# EAGLE schematic superH_rev4_release (EAGLE 7.6.0)

## Sheet 1 of 9
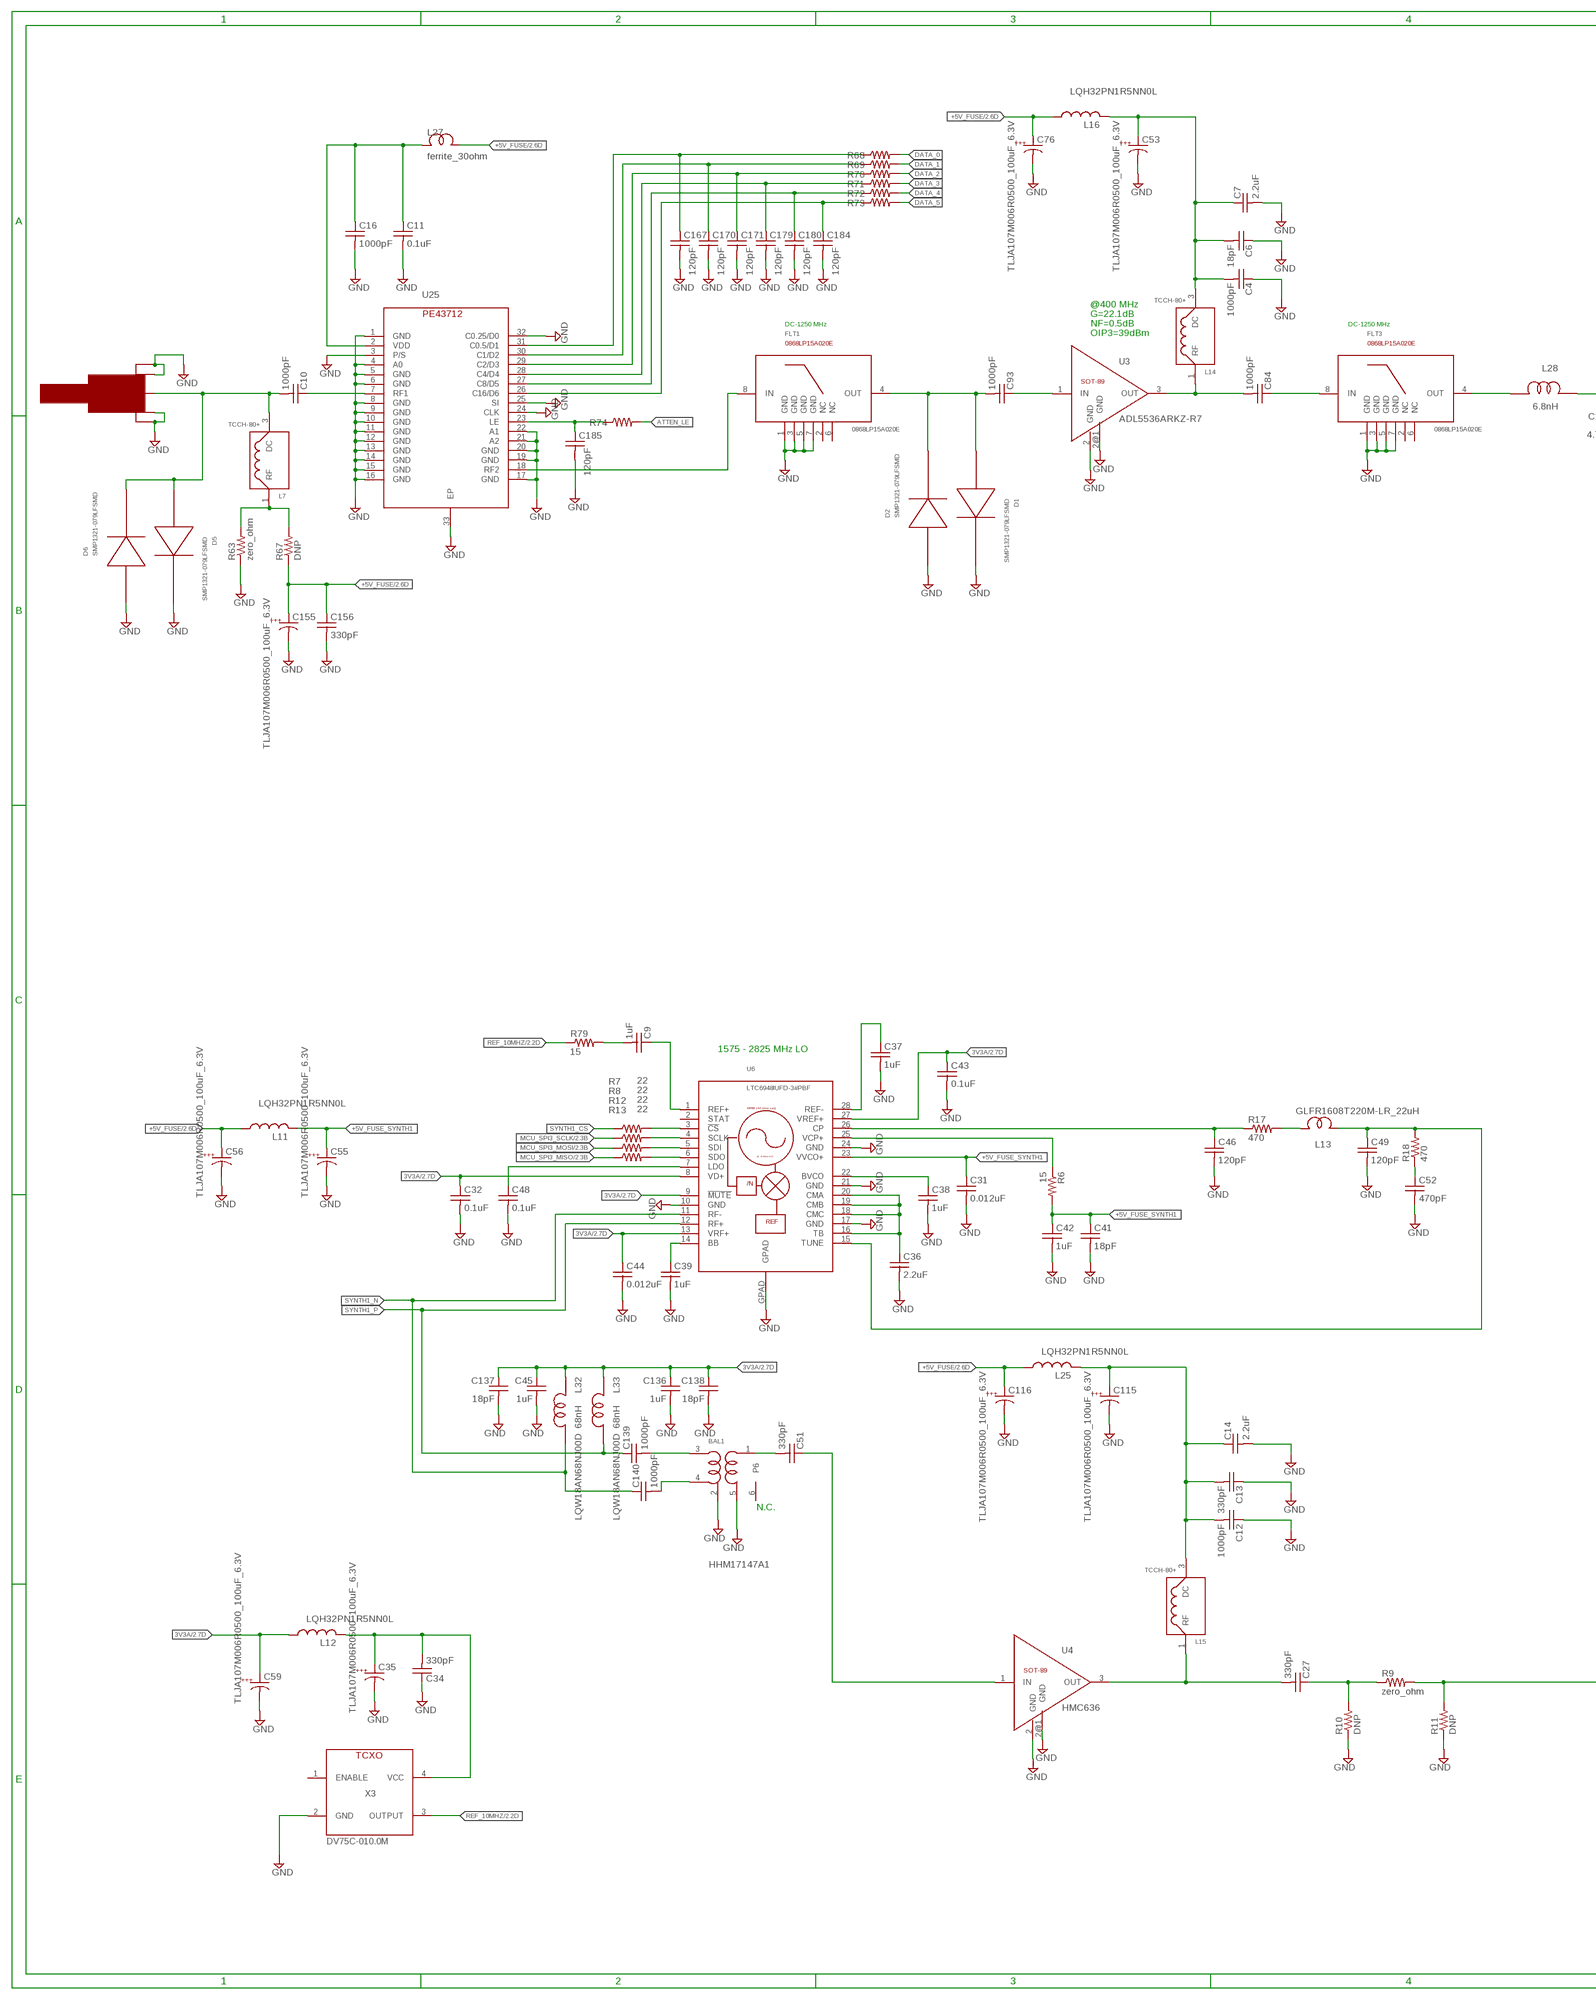
[diagram p0: schematic, sheet 1, part 1 of 2]
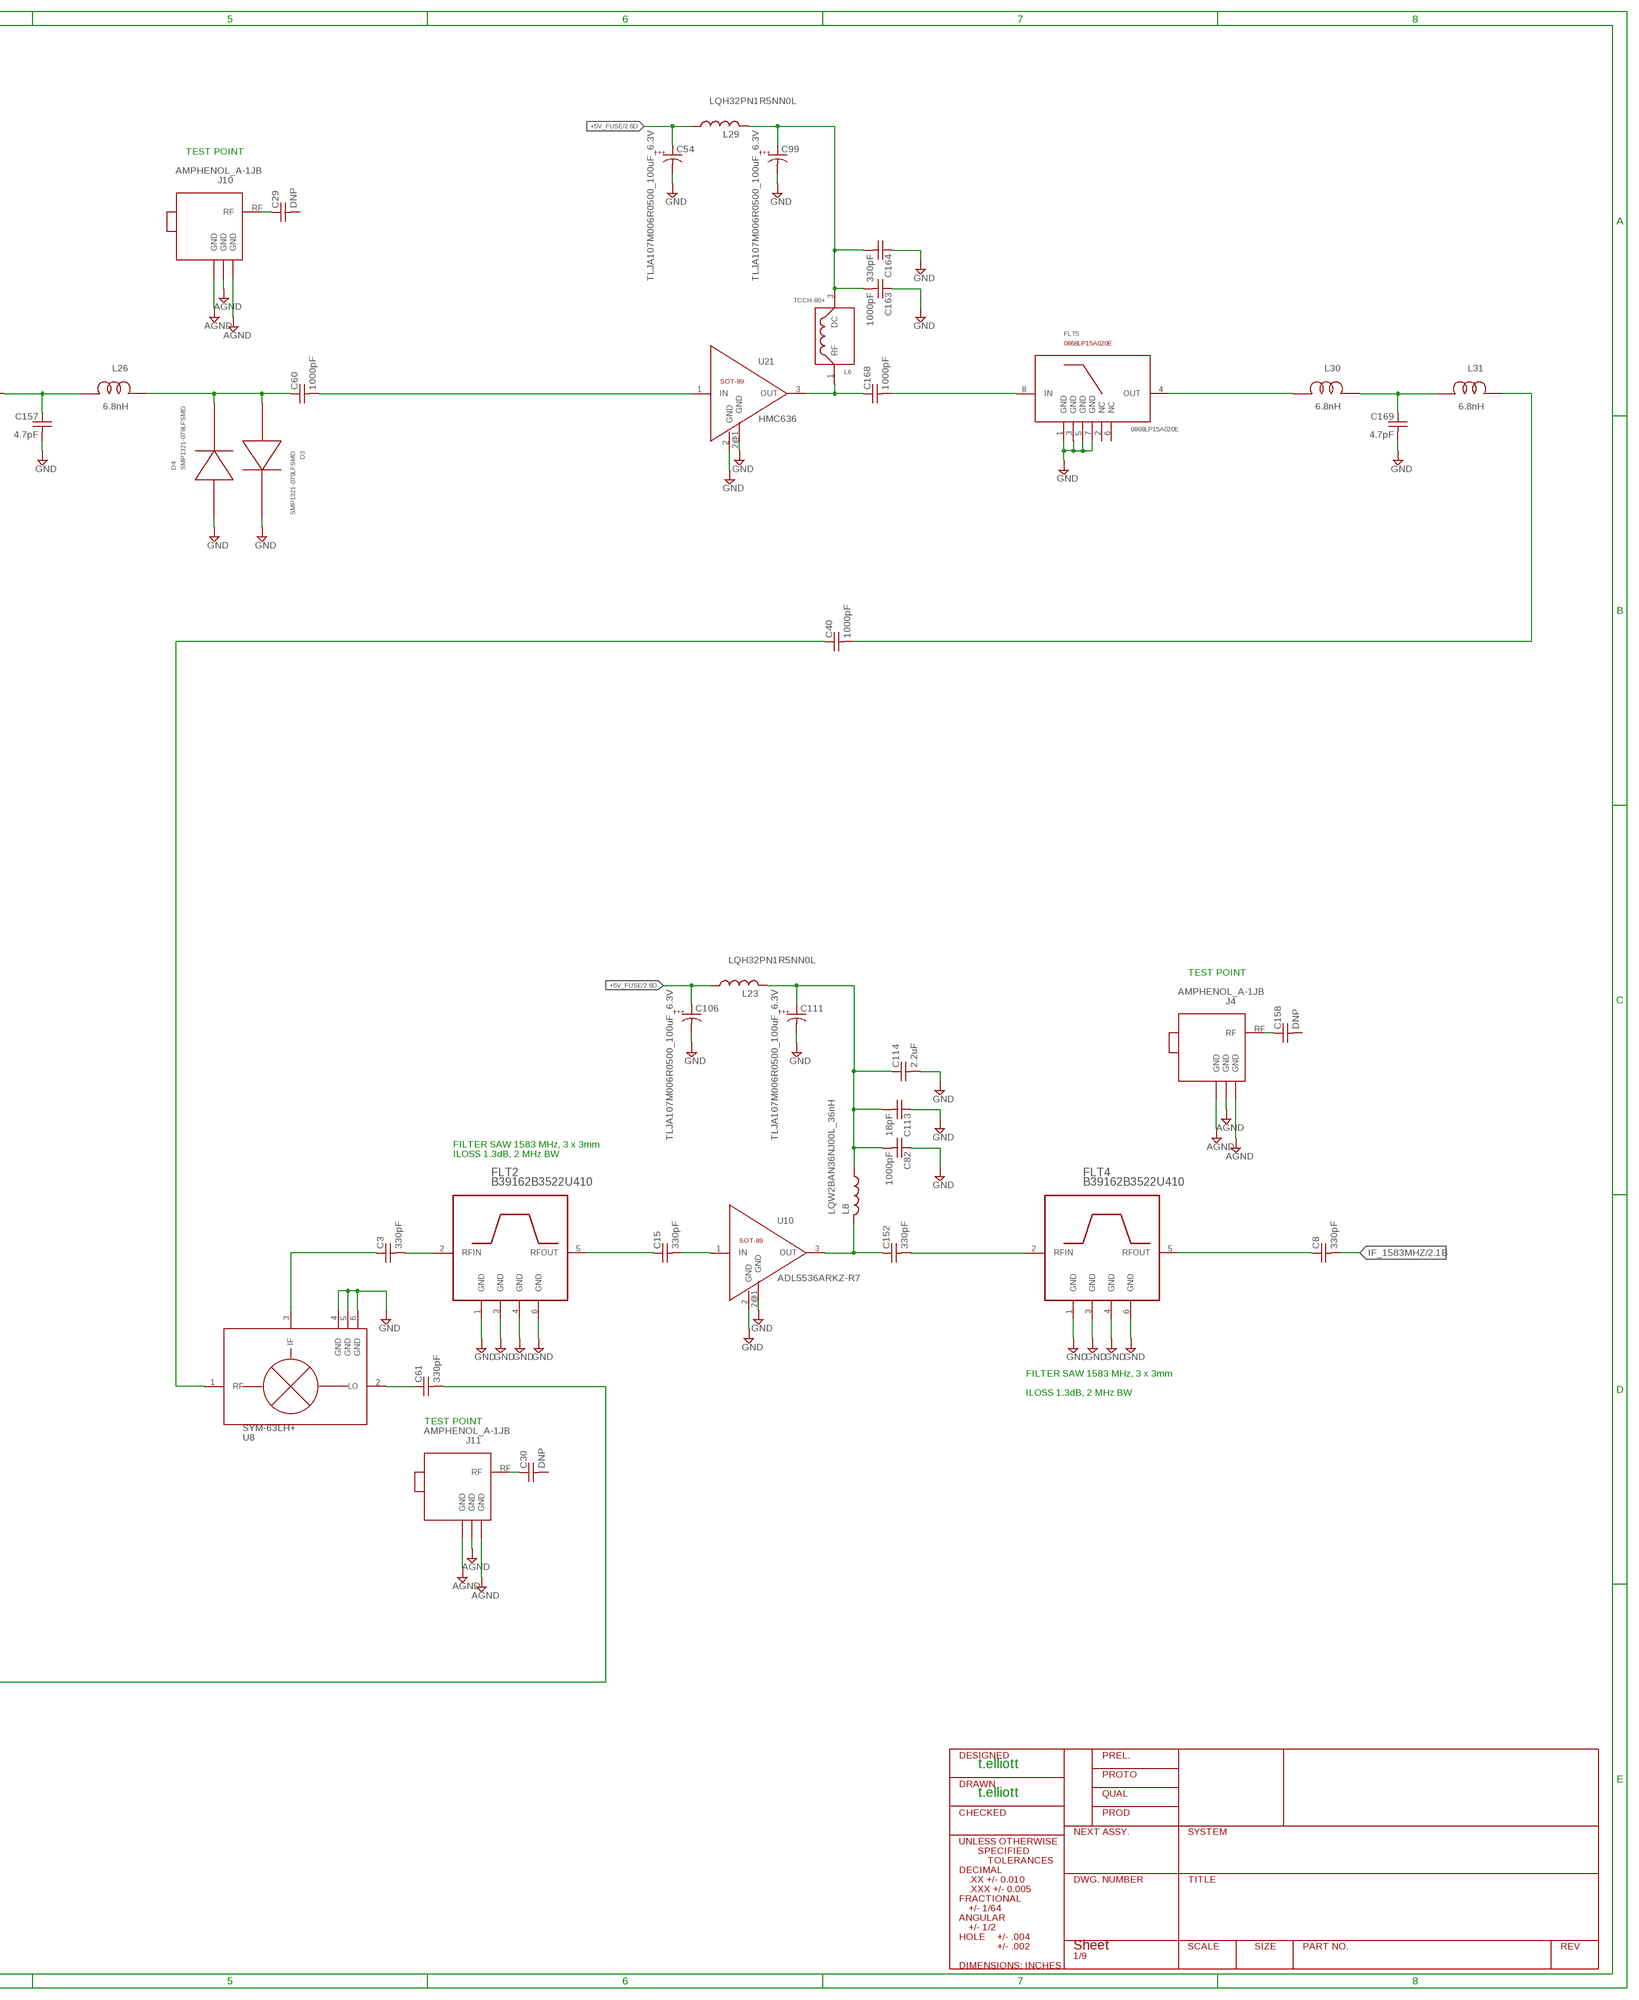
[diagram p1: schematic, sheet 1, part 2 of 2]

### Parts
BAL1  HHM17147A1  BALUN_TDK_HHM1522B1B  [TDK_BALUN_5PIN]
C3  330pF  C-USC0603  [C0603]
C4  1000pF  C-USC0603  [C0603]
C6  18pF  C-USC0603  [C0603]
C7  2.2uF  C-USC0603  [C0603]
C8  330pF  C-USC0603  [C0603]
C9  1uF  C-USC0603  [C0603]
C10  1000pF  C-USC0603  [C0603]
C11  0.1uF  C-USC0402  [C0402]
C12  1000pF  C-USC0603  [C0603]
C13  330pF  C-USC0603  [C0603]
C14  2.2uF  C-USC0603  [C0603]
C15  330pF  C-USC0603  [C0603]
C16  1000pF  C-USC0402  [C0402]
C27  330pF  C-USC0603  [C0603]
C29  DNP  C-USC0603  [C0603]
C30  DNP  C-USC0603  [C0603]
C31  0.012uF  C-USC0402  [C0402]
C32  0.1uF  C-USC0402  [C0402]
C34  330pF  C-USC0603  [C0603]
C35  TLJA107M006R0500_100uF_6.3V  CAPACITOR1210K  [1210K]
C36  2.2uF  C-USC0603  [C0603]
C37  1uF  C-USC0402  [C0402]
C38  1uF  C-USC0402  [C0402]
C39  1uF  C-USC0402  [C0402]
C40  1000pF  C-USC0603  [C0603]
C41  18pF  C-USC0402  [C0402]
C42  1uF  C-USC0402  [C0402]
C43  0.1uF  C-USC0402  [C0402]
C44  0.012uF  C-USC0402  [C0402]
C45  1uF  C-USC0603  [C0603]
C46  120pF  C-USC0402  [C0402]
C48  0.1uF  C-USC0402  [C0402]
C49  120pF  C-USC0402  [C0402]
C51  330pF  C-USC0603  [C0603]
C52  470pF  C-USC0402  [C0402]
C53  TLJA107M006R0500_100uF_6.3V  CAPACITOR1210K  [1210K]
C54  TLJA107M006R0500_100uF_6.3V  CAPACITOR1210K  [1210K]
C55  TLJA107M006R0500_100uF_6.3V  CAPACITOR1210K  [1210K]
C56  TLJA107M006R0500_100uF_6.3V  CAPACITOR1210K  [1210K]
C59  TLJA107M006R0500_100uF_6.3V  CAPACITOR1210K  [1210K]
C60  1000pF  C-USC0603  [C0603]
C61  330pF  C-USC0603  [C0603]
C76  TLJA107M006R0500_100uF_6.3V  CAPACITOR1210K  [1210K]
C82  1000pF  C-USC0603  [C0603]
C84  1000pF  C-USC0603  [C0603]
C93  1000pF  C-USC0603  [C0603]
C99  TLJA107M006R0500_100uF_6.3V  CAPACITOR1210K  [1210K]
C106  TLJA107M006R0500_100uF_6.3V  CAPACITOR1210K  [1210K]
C111  TLJA107M006R0500_100uF_6.3V  CAPACITOR1210K  [1210K]
C113  18pF  C-USC0603  [C0603]
C114  2.2uF  C-USC0603  [C0603]
C115  TLJA107M006R0500_100uF_6.3V  CAPACITOR1210K  [1210K]
C116  TLJA107M006R0500_100uF_6.3V  CAPACITOR1210K  [1210K]
C136  1uF  C-USC0603  [C0603]
C137  18pF  C-USC0603  [C0603]
C138  18pF  C-USC0603  [C0603]
C139  1000pF  C-USC0402  [C0402]
C140  1000pF  C-USC0402  [C0402]
C152  330pF  C-USC0603  [C0603]
C155  TLJA107M006R0500_100uF_6.3V  CAPACITOR1210K  [1210K]
C156  330pF  C-USC0603  [C0603]
C157  4.7pF  C-USC0603  [C0603]
C158  DNP  C-USC0603  [C0603]
C163  1000pF  C-USC0603  [C0603]
C164  330pF  C-USC0603  [C0603]
C167  120pF  C-USC0402  [C0402]
C168  1000pF  C-USC0603  [C0603]
C169  4.7pF  C-USC0603  [C0603]
C170  120pF  C-USC0402  [C0402]
C171  120pF  C-USC0402  [C0402]
C179  120pF  C-USC0402  [C0402]
C180  120pF  C-USC0402  [C0402]
C184  120pF  C-USC0402  [C0402]
C185  120pF  C-USC0402  [C0402]
D1  SMP1321-079LFSMD  [SC-79_PINDIODE]
D2  SMP1321-079LFSMD  [SC-79_PINDIODE]
D3  SMP1321-079LFSMD  [SC-79_PINDIODE]
D4  SMP1321-079LFSMD  [SC-79_PINDIODE]
D5  SMP1321-079LFSMD  [SC-79_PINDIODE]
D6  SMP1321-079LFSMD  [SC-79_PINDIODE]
FLT1  0868LP15A020E  [LPF_0868LP15A020]
FLT2  B39162B3522U410  SF2049E  [SM3030-6]
FLT3  0868LP15A020E  [LPF_0868LP15A020]
FLT4  B39162B3522U410  SF2049E  [SM3030-6]
FLT5  0868LP15A020E  [LPF_0868LP15A020]
J3  SMA0.062  [SMA_EDGE]
J4  AMPHENOL_A-1JB  [UFLCONNECTOR]
J10  AMPHENOL_A-1JB  [UFLCONNECTOR]
J11  AMPHENOL_A-1JB  [UFLCONNECTOR]
L6  TCCH-80+  TCCH-80+GU1604  [TCCH-80+]
L7  TCCH-80+  TCCH-80+GU1604  [TCCH-80+]
L8  LQW2BAN36NJ00L_36nH  L-USL2012C  [L2012C]
L11  LQH32PN1R5NN0L  L-USL3225M  [L3225M]
L12  LQH32PN1R5NN0L  L-USL3225M  [L3225M]
L13  GLFR1608T220M-LR_22uH  WE-CBF_0603  [0603]
L14  TCCH-80+  TCCH-80+GU1604  [TCCH-80+]
L15  TCCH-80+  TCCH-80+GU1604  [TCCH-80+]
L16  LQH32PN1R5NN0L  L-USL3225M  [L3225M]
L23  LQH32PN1R5NN0L  L-USL3225M  [L3225M]
L25  LQH32PN1R5NN0L  L-USL3225M  [L3225M]
L26  6.8nH  COILCRAFT_0806SQ-16N  [MURATA_LQW_0603]
L27  ferrite_30ohm  WE-CBF_0603  [0603]
L28  6.8nH  COILCRAFT_0806SQ-16N  [MURATA_LQW_0603]
L29  LQH32PN1R5NN0L  L-USL3225M  [L3225M]
L30  6.8nH  COILCRAFT_0806SQ-16N  [MURATA_LQW_0603]
L31  6.8nH  COILCRAFT_0806SQ-16N  [MURATA_LQW_0603]
L32  LQW18AN68NJ00D 68nH  COILCRAFT_0806SQ-16N  [MURATA_LQW_0603]
L33  LQW18AN68NJ00D 68nH  COILCRAFT_0806SQ-16N  [MURATA_LQW_0603]
R6  15  R-US_R0402  [R0402]
R7  22  R-US_R0402  [R0603_COMPACT]
R8  22  R-US_R0402  [R0603_COMPACT]
R9  zero_ohm  R-US_R0603  [R0603]
R10  DNP  R-US_R0603  [R0603]
R11  DNP  R-US_R0603  [R0603]
R12  22  R-US_R0402  [R0603_COMPACT]
R13  22  R-US_R0402  [R0603_COMPACT]
R17  470  R-US_R0402  [R0402]
R18  470  R-US_R0402  [R0402]
R63  zero_ohm  R-US_R1206  [R1206]
R67  DNP  R-US_R1206  [R1206]
R68  15  R-US_R0402  [R0402]
R69  15  R-US_R0402  [R0402]
R70  15  R-US_R0402  [R0402]
R71  15  R-US_R0402  [R0402]
R72  15  R-US_R0402  [R0402]
R73  15  R-US_R0402  [R0402]
R74  15  R-US_R0402  [R0402]
R79  15  R-US_R0402  [R0402]
U3  ADL5536ARKZ-R7  PGA-103+  [SOT89]
U4  HMC636  PGA-103+  [SOT89]
U6  LTC6948IUFD-3#PBF  LTC6948QFN28  [QFN28_NONSQ]
U8  SYM-63LH+  SYM-18H+  [SYM-18H]
U10  ADL5536ARKZ-R7  PGA-103+  [SOT89]
U21  HMC636  PGA-103+  [SOT89]
U25  PE43712SMD  [QFN32]
X3  DV75C-010.0M  CWX813-020.0M  [CWX8XX_5MM_7MM]

### Nets
3V3A: C32.1 C43.1 C44.1 C45.1 C59.A C136.1 C137.1 C138.1 L12.1 L32.2 L33.2 U6.8(VD+) U6.9(!MUTE) U6.13(VRF+) U6.27(VREF+) ; also sheet 2,5,8
+5V_ATTEN: C11.1 C16.1 L27.1 U25.2(VDD)
+5V_FUSE: C54.A C56.A C76.A C106.A C116.A C155.A C156.1 L11.1 L16.1 L23.1 L25.1 L27.2 L29.1 R67.1 ; also sheet 2,8
+5V_FUSE_SYNTH1: C31.1 C41.1 C42.1 C55.A L11.2 R6.2 U6.23(VVCO+)
ATTEN_LE: R74.2 ; also sheet 4
BALUN_N [differential]: BAL1.4(BP1) C140.2
BALUN_P [differential]: BAL1.3(BP2) C139.2
D0: C167.1 R68.1 U25.31(C0.5/D1)
D1: C170.1 R69.1 U25.30(C1/D2)
D2: C171.1 R70.1 U25.29(C2/D3)
D3: C179.1 R71.1 U25.28(C4/D4)
D4: C180.1 R72.1 U25.27(C8/D5)
D5: C184.1 R73.1 U25.26(C16/D6)
DATA_0: R68.2 ; also sheet 2,3
DATA_1: R69.2 ; also sheet 2,3
DATA_2: R70.2 ; also sheet 2,3
DATA_3: R71.2 ; also sheet 2,3
DATA_4: R72.2 ; also sheet 4
DATA_5: R73.2 ; also sheet 3
GND: BAL1.2(FEED) BAL1.5(GND) C4.1 C6.1 C7.2 C11.2 C12.1 C13.1 C14.2 C16.2 C31.2 C32.2 C34.1 C35.C C36.2 C37.2 C38.2 C39.2 C41.2 C42.2 C43.2 C44.2 C45.2 C46.2 C48.2 C49.2 C52.2 C53.C C54.C C55.C C56.C C59.C C76.C C82.1 C99.C C106.C C111.C C113.1 C114.2 C115.C C116.C C136.2 C137.2 C138.2 C155.C C156.2 C157.2 C163.1 C164.1 C167.2 C169.2 C170.2 C171.2 C179.2 C180.2 C184.2 C185.2 D1.C D2.A D3.C D4.A D5.C D6.A FLT1.1(GND) FLT1.3(GND) FLT1.5(GND) FLT1.7(GND) FLT2.1(GND) FLT2.3(GND) FLT2.4(GND) FLT2.6(GND) FLT3.1(GND) FLT3.3(GND) FLT3.5(GND) FLT3.7(GND) FLT4.1(GND) FLT4.3(GND) FLT4.4(GND) FLT4.6(GND) FLT5.1(GND) FLT5.3(GND) FLT5.5(GND) FLT5.7(GND) J3.GND@1(GND) J3.GND@2(GND) J3.GND@3(GND) J3.GND@4(GND) J4.1(GND) J4.2(GND) J4.3(GND) J10.1(GND) J10.2(GND) J10.3(GND) J11.1(GND) J11.2(GND) J11.3(GND) R10.1 R11.1 R63.1 U3.2(GND) U3.2@1(GND) U4.2(GND) U4.2@1(GND) U6.10(GND) U6.17(GND) U6.21(GND) U6.24(GND) U6.GPAD U8.4(GND) U8.5(GND) U8.6(GND) U10.2(GND) U10.2@1(GND) U21.2(GND) U21.2@1(GND) U25.1(GND) U25.3(P/S) U25.4(A0) U25.5(GND) U25.6(GND) U25.8(GND) U25.9(GND) U25.10(GND) U25.11(GND) U25.12(GND) U25.13(GND) U25.14(GND) U25.15(GND) U25.16(GND) U25.17(GND) U25.19(GND) U25.20(GND) U25.21(A2) U25.22(A1) U25.24(CLK) U25.25(SI) U25.32(C0.25/D0) U25.33(EP) X3.2(GND) ; supply symbol labelled AGND ; also sheet 2,3,4,5,6,7,8,9
IF_1583MHZ: C8.2 ; also sheet 2
LE: C185.1 R74.1 U25.23(LE)
MCU_SPI3_MISO: R13.1 ; also sheet 2,4
MCU_SPI3_MOSI: R12.1 ; also sheet 2,4
MCU_SPI3_SCLK: R8.1 ; also sheet 2,4
N$1: C152.2 FLT4.2(RFIN)
N$2: C84.2 L14.1(RF) U3.3(OUT)
N$5: C82.2 C111.A C113.2 C114.1 L8.1 L23.2
N$14: C60.1 D3.A D4.C L26.2
N$18: C27.2 L15.1(RF) U4.3(OUT)
N$31: C29.1 J10.RF
N$32: C30.1 J11.RF
N$36: C15.1 FLT2.5(RFOUT)
N$39: C3.2 FLT2.2(RFIN)
N$44: C51.1 U4.1(IN)
N$45: C15.2 U10.1(IN)
N$47: C9.1 U6.1(REF+)
N$48: C27.1 R9.1 R10.2
N$49: C61.2 R9.2 R11.2
N$50: C4.2 C6.2 C7.1 C53.A L14.3(DC) L16.2
N$52: C8.1 FLT4.5(RFOUT)
N$58: FLT1.8(IN) U25.18(RF2)
N$61: C99.A C163.2 C164.2 L6.3(DC) L29.2
N$64: C37.1 U6.28(REF-)
N$67: C36.1 U6.16(TB) U6.18(CMC) U6.19(CMB) U6.20(CMA)
N$73: C38.1 U6.22(BVCO)
N$75: C39.1 U6.14(BB)
N$78: R6.1 U6.25(VCP+)
N$79: C48.1 U6.7(LDO)
N$80: C46.1 R17.1 U6.26(CP)
N$81: C61.1 U8.2(LO)
N$82: C93.1 U3.1(IN)
N$87: BAL1.1(UBAL) C51.2
N$88: C52.1 R18.1
N$89: C49.1 L13.2 R18.2 U6.15(TUNE)
N$90: L13.1 R17.2
N$93: C93.2 D1.A D2.C FLT1.4(OUT)
N$97: R7.2 U6.3(!CS)
N$101: R8.2 U6.4(SCLK)
N$102: R12.2 U6.5(SDI)
N$103: R13.2 U6.6(SDO)
N$105: C34.2 C35.A L12.2 X3.4(VCC)
N$106: C3.1 U8.3(IF)
N$107: C157.1 L26.1 L28.2
N$113: FLT3.4(OUT) L28.1
N$121: L7.1(RF) R63.2 R67.2
N$136: C152.1 L8.2 U10.3(OUT)
N$137: C84.1 FLT3.8(IN)
N$138: C158.1 J4.RF
N$144: C60.2 U21.1(IN)
N$145: C168.1 L6.1(RF) U21.3(OUT)
N$146: C40.1 U8.1(RF)
N$147: FLT5.4(OUT) L30.1
N$148: C169.1 L30.2 L31.1
N$149: C168.2 FLT5.8(IN)
N$151: C40.2 L31.2
N$188: C10.1 U25.7(RF1)
N$195: C10.2 D5.A D6.C J3.RF L7.3(DC)
N$205: C9.2 R79.2
N$999: C12.2 C13.2 C14.1 C115.A L15.3(DC) L25.2
REF_10MHZ: R79.1 X3.3(OUTPUT) ; also sheet 2
SYNTH1_CS: R7.1 ; also sheet 3
SYNTH1_N [differential]: C140.1 L32.1 U6.11(RF-)
SYNTH1_P [differential]: C139.1 L33.1 U6.12(RF+)
Unconnected: BAL1.6 C29.2 C30.2 C158.2 FLT1.2(NC) FLT1.6(NC) FLT3.2(NC) FLT3.6(NC) FLT5.2(NC) FLT5.6(NC) U6.2(STAT) X3.1(ENABLE)

### Notes on the sheet
- TEST POINT
- @400 MHz
- G=22.1dB
- DC-1250 MHz | NF=0.5dB | DC-1250 MHz
- OIP3=39dBm
- TEST POINT
- 1575 - 2825 MHz LO
- FILTER SAW 1583 MHz, 3 x 3mm
- ILOSS 1.3dB, 2 MHz BW
- FILTER SAW 1583 MHz, 3 x 3mm
- ILOSS 1.3dB, 2 MHz BW
- TEST POINT
- N.C.
- t.elliott
- t.elliott

## Sheet 2 of 9
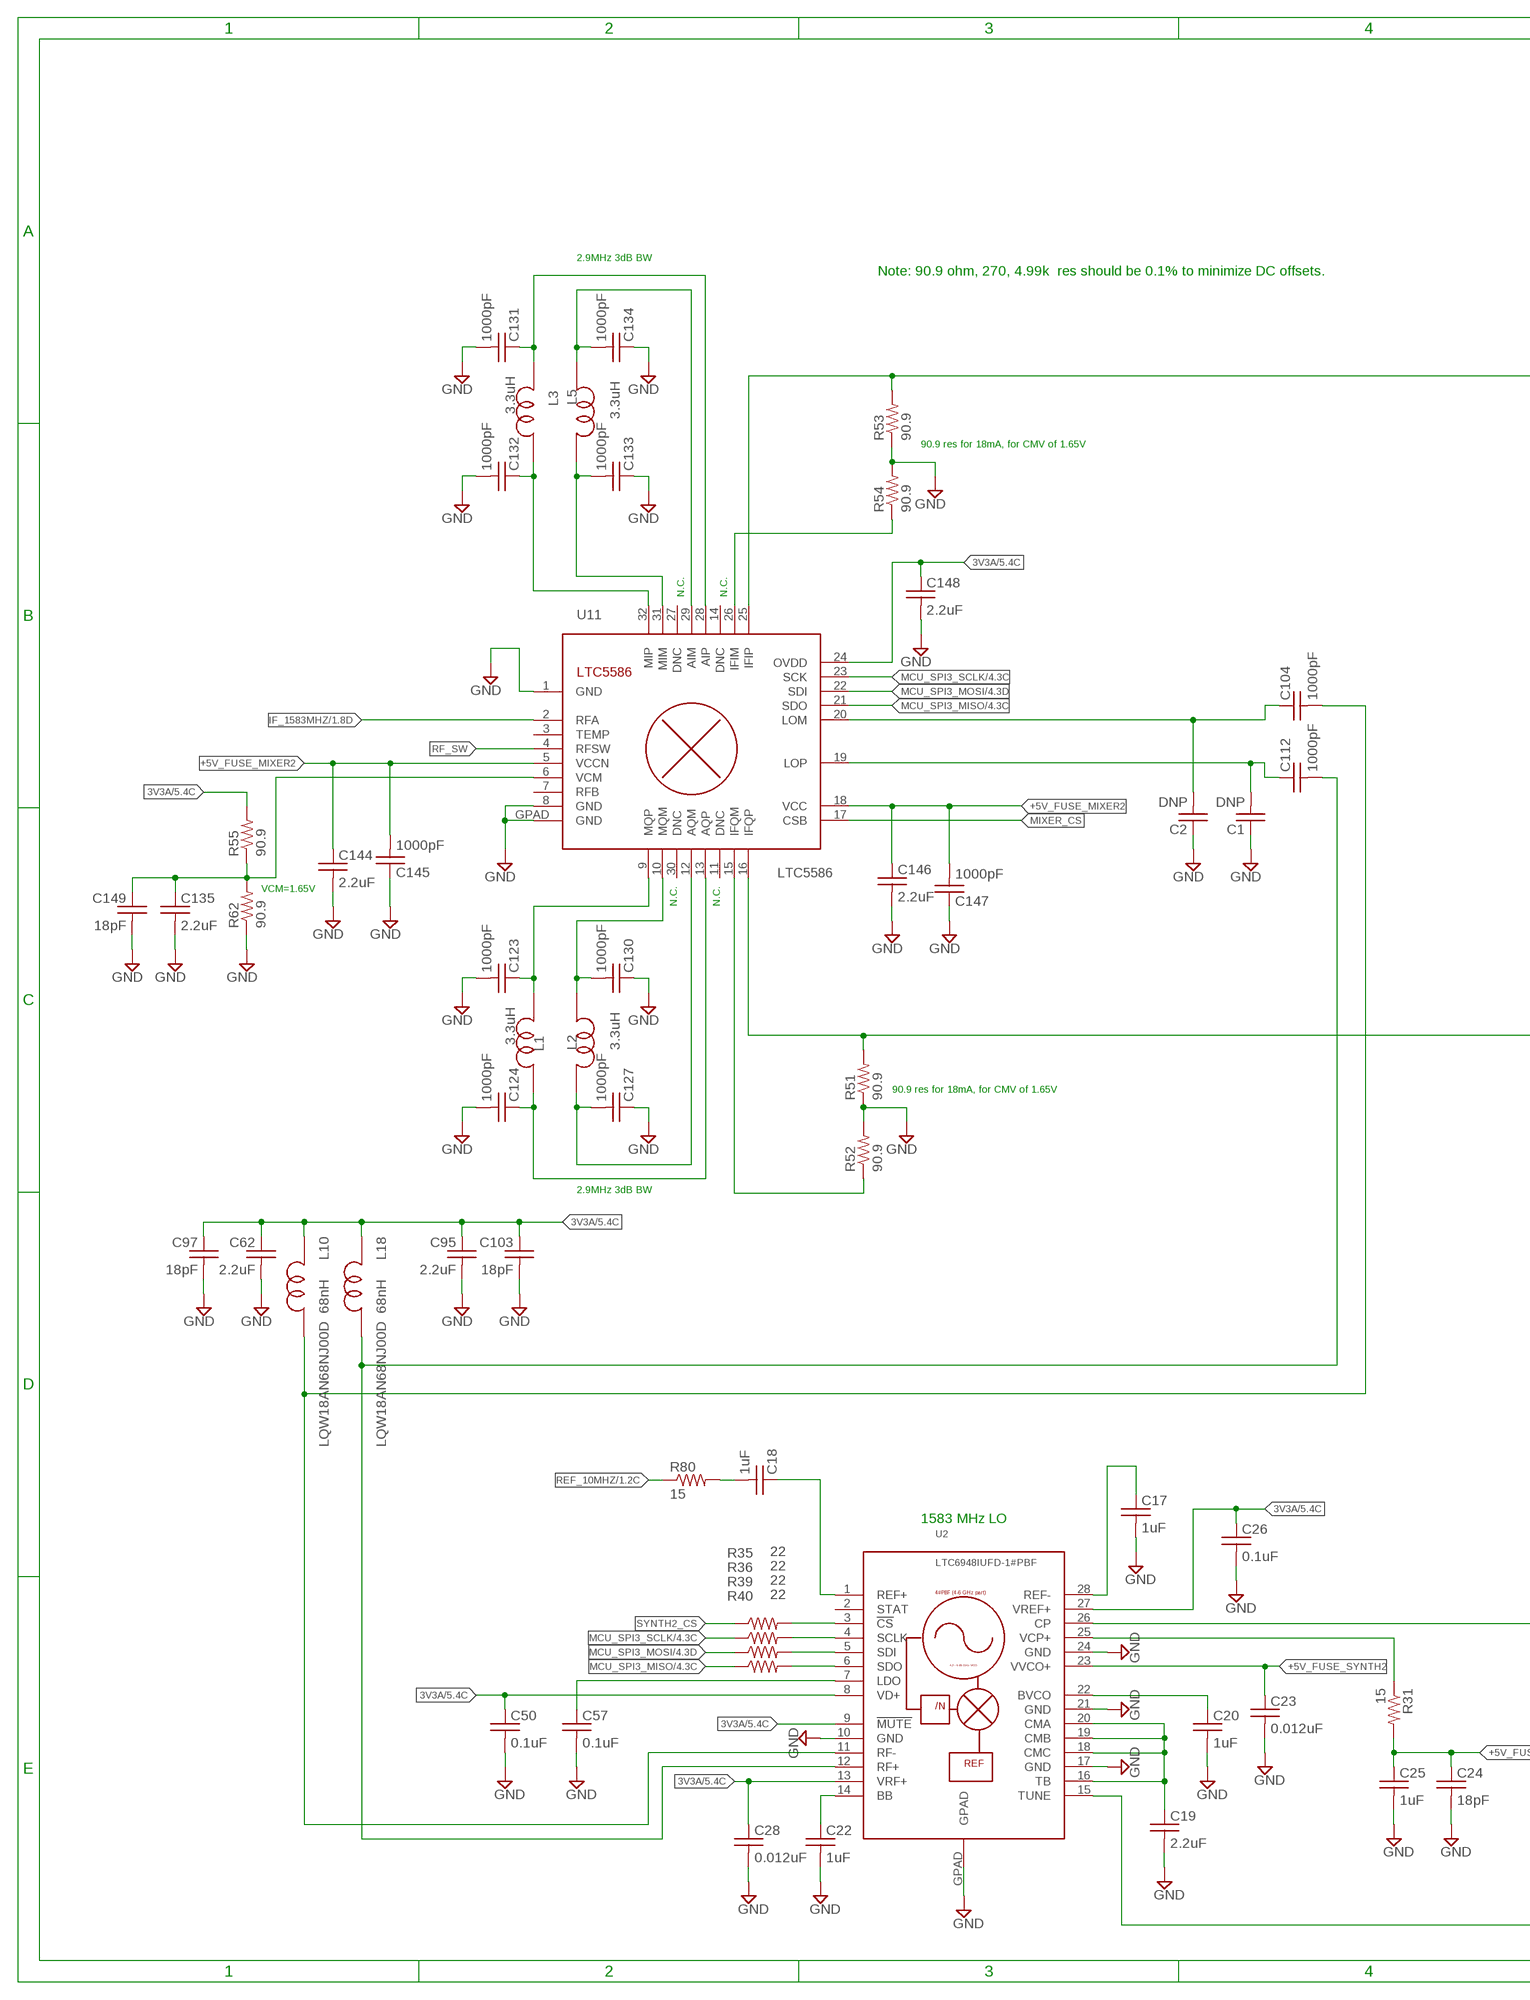
[diagram p2: schematic, sheet 2, part 1 of 2]
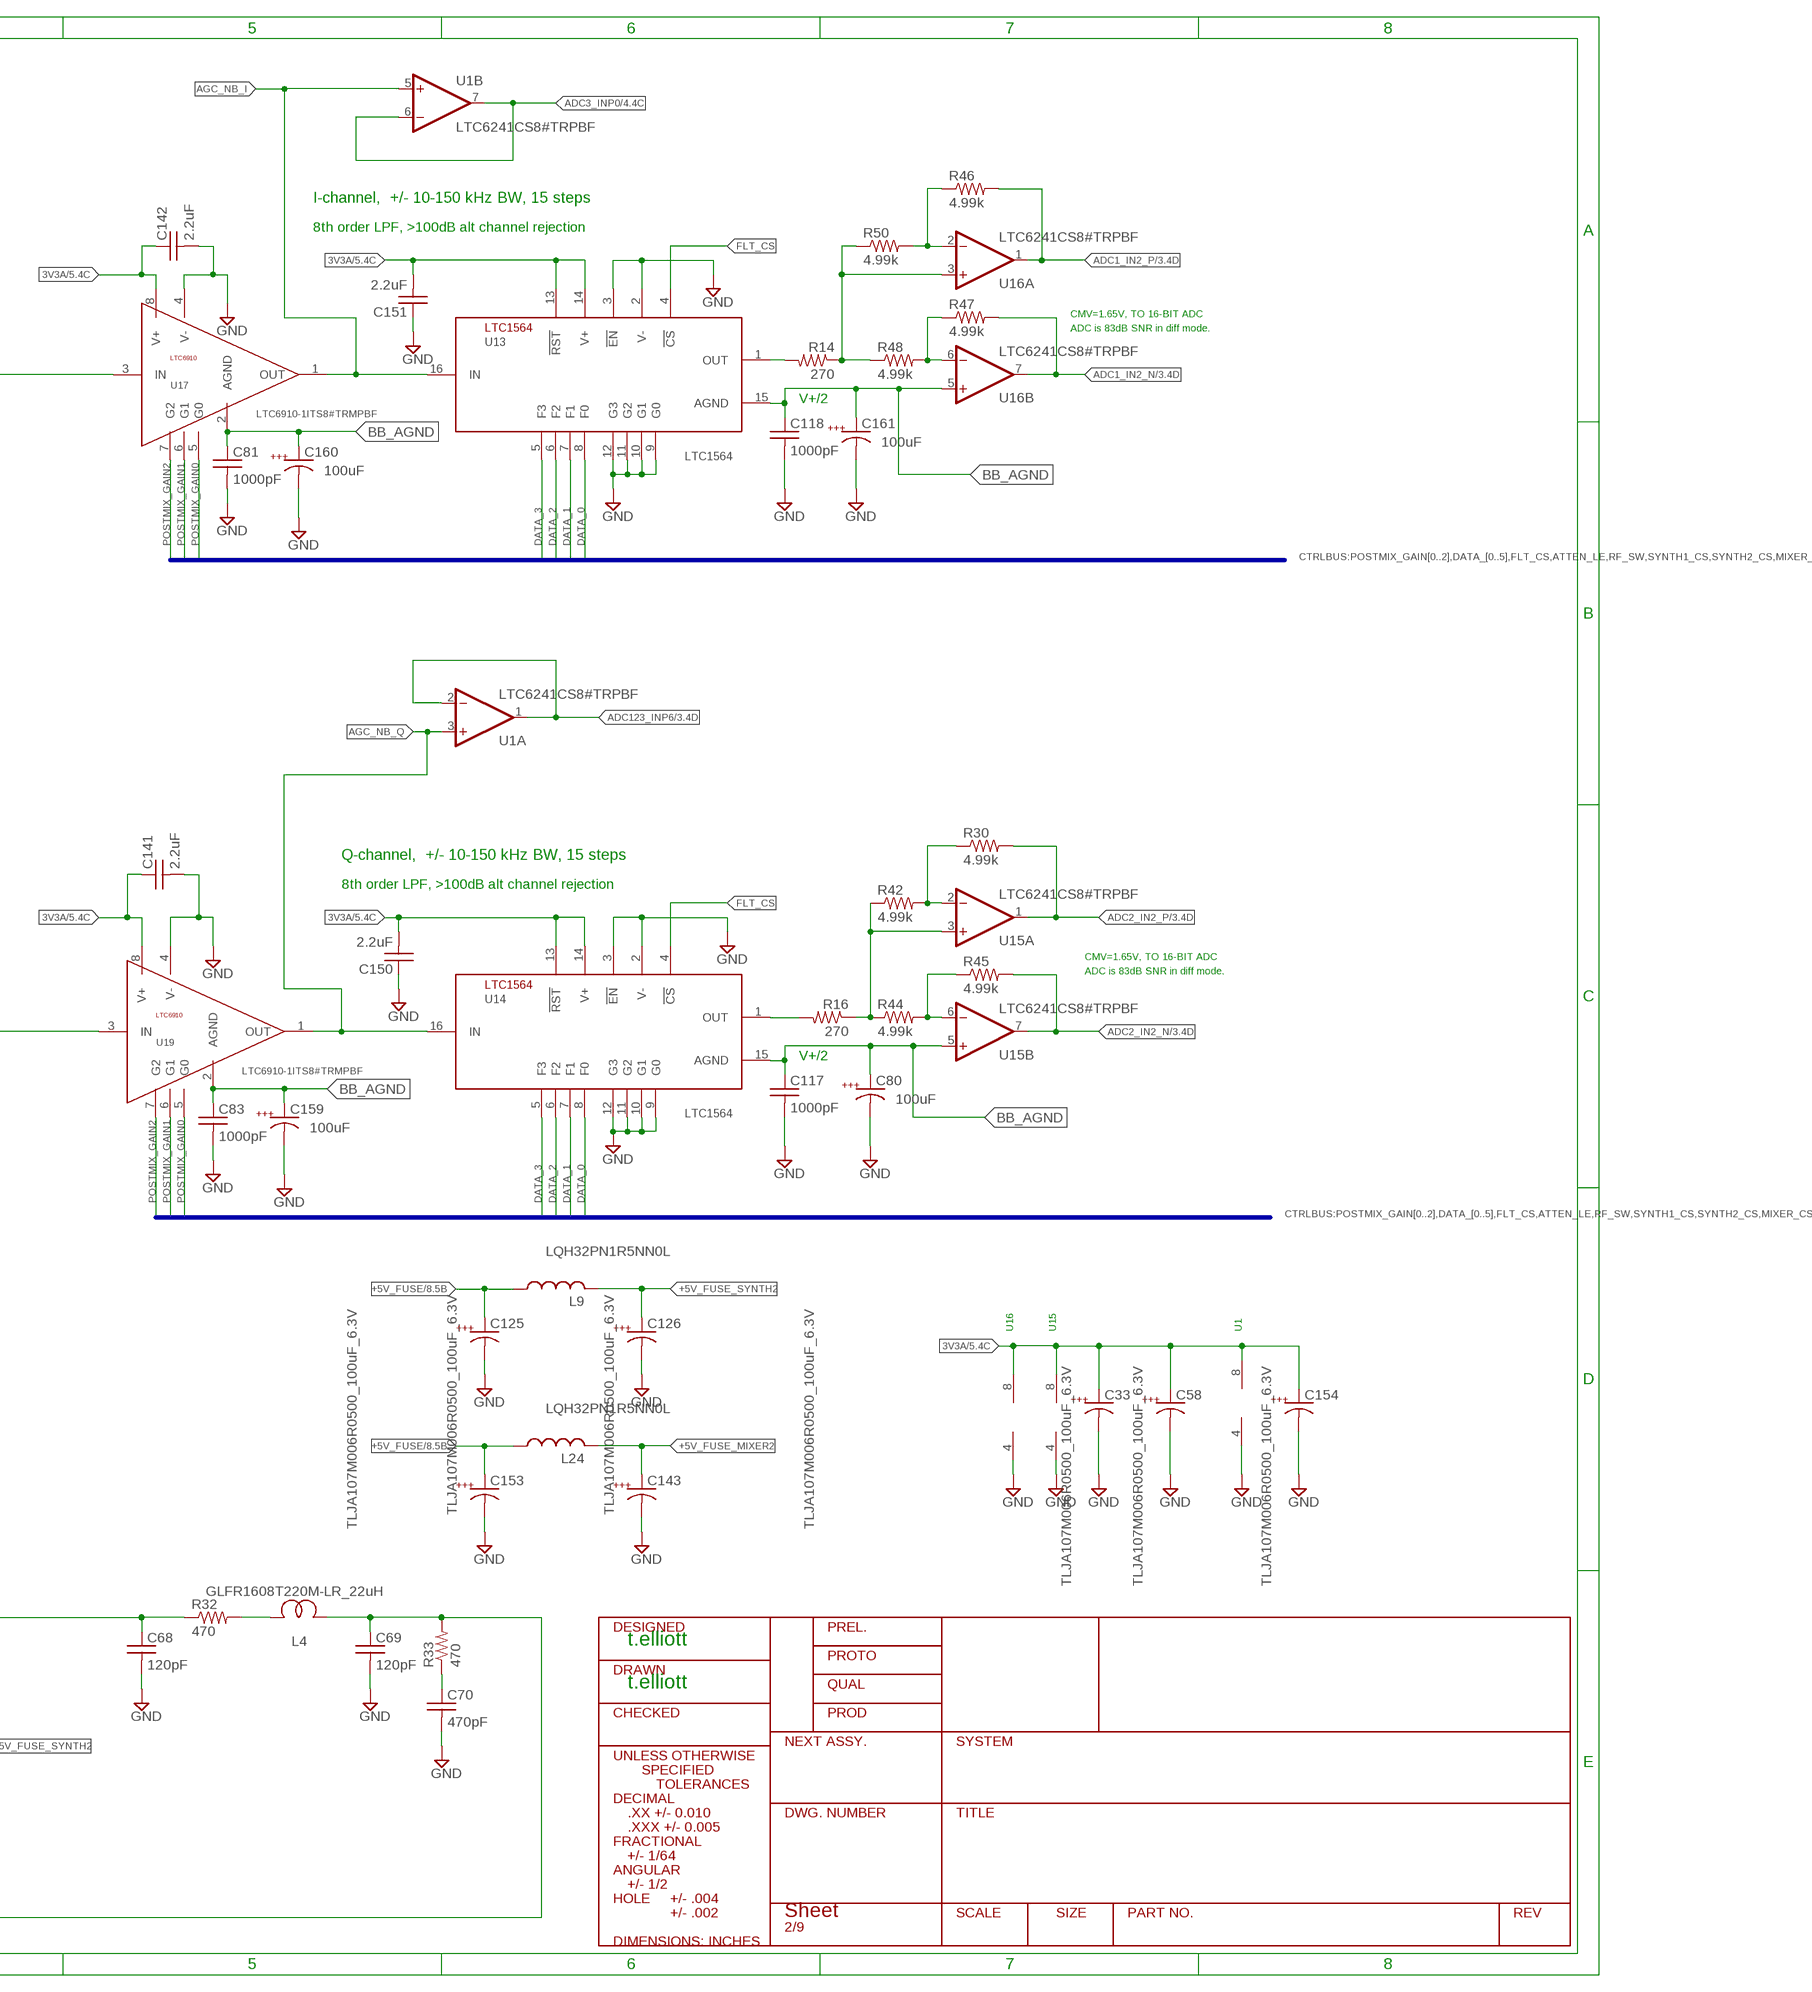
[diagram p3: schematic, sheet 2, part 2 of 2]

### Parts
C1  DNP  C-USC0402  [C0402]
C2  DNP  C-USC0402  [C0402]
C17  1uF  C-USC0402  [C0402]
C18  1uF  C-USC0603  [C0603]
C19  2.2uF  C-USC0603  [C0603]
C20  1uF  C-USC0402  [C0402]
C22  1uF  C-USC0402  [C0402]
C23  0.012uF  C-USC0402  [C0402]
C24  18pF  C-USC0402  [C0402]
C25  1uF  C-USC0402  [C0402]
C26  0.1uF  C-USC0402  [C0402]
C28  0.012uF  C-USC0402  [C0402]
C33  TLJA107M006R0500_100uF_6.3V  CAPACITOR1210K  [1210K]
C50  0.1uF  C-USC0402  [C0402]
C57  0.1uF  C-USC0402  [C0402]
C58  TLJA107M006R0500_100uF_6.3V  CAPACITOR1210K  [1210K]
C62  2.2uF  C-USC0603  [C0603]
C68  120pF  C-USC0402  [C0402]
C69  120pF  C-USC0402  [C0402]
C70  470pF  C-USC0402  [C0402]
C80  100uF  CAPACITOR1210K  [1210K]
C81  1000pF  C-USC0603  [C0603]
C83  1000pF  C-USC0603  [C0603]
C95  2.2uF  C-USC0603  [C0603]
C97  18pF  C-USC0603  [C0603]
C103  18pF  C-USC0603  [C0603]
C104  1000pF  C-USC0402  [C0402]
C112  1000pF  C-USC0402  [C0402]
C117  1000pF  C-USC0603  [C0603]
C118  1000pF  C-USC0603  [C0603]
C123  1000pF  C-USC0603  [C0603]
C124  1000pF  C-USC0603  [C0603]
C125  TLJA107M006R0500_100uF_6.3V  CAPACITOR1210K  [1210K]
C126  TLJA107M006R0500_100uF_6.3V  CAPACITOR1210K  [1210K]
C127  1000pF  C-USC0603  [C0603]
C130  1000pF  C-USC0603  [C0603]
C131  1000pF  C-USC0603  [C0603]
C132  1000pF  C-USC0603  [C0603]
C133  1000pF  C-USC0603  [C0603]
C134  1000pF  C-USC0603  [C0603]
C135  2.2uF  C-USC0603  [C0603]
C141  2.2uF  C-USC0402  [C0402]
C142  2.2uF  C-USC0402  [C0402]
C143  TLJA107M006R0500_100uF_6.3V  CAPACITOR1210K  [1210K]
C144  2.2uF  C-USC0402  [C0402]
C145  1000pF  C-USC0402  [C0402]
C146  2.2uF  C-USC0402  [C0402]
C147  1000pF  C-USC0402  [C0402]
C148  2.2uF  C-USC0402  [C0402]
C149  18pF  C-USC0603  [C0603]
C150  2.2uF  C-USC0402  [C0402]
C151  2.2uF  C-USC0402  [C0402]
C153  TLJA107M006R0500_100uF_6.3V  CAPACITOR1210K  [1210K]
C154  TLJA107M006R0500_100uF_6.3V  CAPACITOR1210K  [1210K]
C159  100uF  CAPACITOR1210K  [1210K]
C160  100uF  CAPACITOR1210K  [1210K]
C161  100uF  CAPACITOR1210K  [1210K]
L1  3.3uH  COILCRAFT_0806SQ-16N  [MURATA_LQW_0603]
L2  3.3uH  COILCRAFT_0806SQ-16N  [MURATA_LQW_0603]
L3  3.3uH  COILCRAFT_0806SQ-16N  [MURATA_LQW_0603]
L4  GLFR1608T220M-LR_22uH  WE-CBF_0603  [0603]
L5  3.3uH  COILCRAFT_0806SQ-16N  [MURATA_LQW_0603]
L9  LQH32PN1R5NN0L  L-USL3225M  [L3225M]
L10  LQW18AN68NJ00D 68nH  COILCRAFT_0806SQ-16N  [MURATA_LQW_0603]
L18  LQW18AN68NJ00D 68nH  COILCRAFT_0806SQ-16N  [MURATA_LQW_0603]
L24  LQH32PN1R5NN0L  L-USL3225M  [L3225M]
R14  270  R-US_R0603  [R0603]
R16  270  R-US_R0603  [R0603]
R30  4.99k  R-US_R0402  [R0402]
R31  15  R-US_R0402  [R0402]
R32  470  R-US_R0402  [R0402]
R33  470  R-US_R0402  [R0402]
R35  22  R-US_R0402  [R0603_COMPACT]
R36  22  R-US_R0402  [R0603_COMPACT]
R39  22  R-US_R0402  [R0603_COMPACT]
R40  22  R-US_R0402  [R0603_COMPACT]
R42  4.99k  R-US_R0402  [R0402]
R44  4.99k  R-US_R0402  [R0402]
R45  4.99k  R-US_R0402  [R0402]
R46  4.99k  R-US_R0402  [R0402]
R47  4.99k  R-US_R0402  [R0402]
R48  4.99k  R-US_R0402  [R0402]
R50  4.99k  R-US_R0402  [R0402]
R51  90.9  R-US_R0402  [R0402]
R52  90.9  R-US_R0402  [R0402]
R53  90.9  R-US_R0402  [R0402]
R54  90.9  R-US_R0402  [R0402]
R55  90.9  R-US_R0402  [R0402]
R62  90.9  R-US_R0402  [R0402]
R80  15  R-US_R0402  [R0402]
U1  LTC6241CS8#TRPBF  LM1458D  [SO08]
U2  LTC6948IUFD-1#PBF  LTC6948QFN28  [QFN28_NONSQ]
U11  LTC5586  [QFN32]
U13  LTC1564  [SSOP16]
U14  LTC1564  [SSOP16]
U15  LTC6241CS8#TRPBF  LM1458D  [SO08]
U16  LTC6241CS8#TRPBF  LM1458D  [SO08]
U17  LTC6910-1ITS8#TRMPBF  LTC6910  [TSOT-23-8]
U19  LTC6910-1ITS8#TRMPBF  LTC6910  [TSOT-23-8]

### Nets
3V3A: C26.1 C28.1 C33.A C50.1 C58.A C62.1 C95.1 C97.1 C103.1 C141.1 C142.1 C148.1 C150.2 C151.2 C154.A L10.2 L18.2 R55.2 U1.8(P:V+) U2.8(VD+) U2.9(!MUTE) U2.13(VRF+) U2.27(VREF+) U11.24(OVDD) U13.13(!RST) U13.14(V+) U14.13(!RST) U14.14(V+) U15.8(P:V+) U16.8(P:V+) U17.8(V+) U19.8(V+) ; also sheet 1,5,8
+5V_FUSE: C125.A C153.A L9.1 L24.1 ; also sheet 1,8
+5V_FUSE_MIXER2: C143.A C144.1 C145.2 C146.1 C147.2 L24.2 U11.5(VCCN) U11.18(VCC)
+5V_FUSE_SYNTH2: C23.1 C24.1 C25.1 C126.A L9.2 R31.2 U2.23(VVCO+)
ADC1_IN2_N [differential]: R47.2 U16.7(B:OUT) ; also sheet 3
ADC1_IN2_P [differential]: R46.2 U16.1(A:OUT) ; also sheet 3
ADC2_IN2_N [differential]: R45.2 U15.7(B:OUT) ; also sheet 3
ADC2_IN2_P [differential]: R30.2 U15.1(A:OUT) ; also sheet 3
ADC3_INP0: U1.6(B:-IN) U1.7(B:OUT) ; also sheet 4
ADC123_INP6: U1.1(A:OUT) U1.2(A:-IN) ; also sheet 3
AGC_NB_I: U1.5(B:+IN) U13.16(IN) U17.1(OUT)
AGC_NB_Q: U1.3(A:+IN) U14.16(IN) U19.1(OUT)
BB_AGND: C80.A C81.1 C83.1 C117.1 C118.1 C159.A C160.A C161.A U13.15(AGND) U14.15(AGND) U15.5(B:+IN) U16.5(B:+IN) U17.2(AGND) U19.2(AGND)
DATA_0: U13.8(F0) U14.8(F0) ; also sheet 1,3
DATA_1: U13.7(F1) U14.7(F1) ; also sheet 1,3
DATA_2: U13.6(F2) U14.6(F2) ; also sheet 1,3
DATA_3: U13.5(F3) U14.5(F3) ; also sheet 1,3
FLT_CS: U13.4(!CS) U14.4(!CS) ; also sheet 4
GND: C1.1 C2.1 C17.2 C19.2 C20.2 C22.2 C23.2 C24.2 C25.2 C26.2 C28.2 C33.C C50.2 C57.2 C58.C C62.2 C68.2 C69.2 C70.2 C80.C C81.2 C83.2 C95.2 C97.2 C103.2 C117.2 C118.2 C123.2 C124.2 C125.C C126.C C127.1 C130.1 C131.2 C132.2 C133.1 C134.1 C135.2 C141.2 C142.2 C143.C C144.2 C145.1 C146.2 C147.1 C148.2 C149.2 C150.1 C151.1 C153.C C154.C C159.C C160.C C161.C R51.1 R52.2 R53.1 R54.2 R62.1 U1.4(P:V-) U2.10(GND) U2.17(GND) U2.21(GND) U2.24(GND) U2.GPAD U11.1(GND) U11.8(GND) U11.GPAD(GND) U13.2(V-) U13.3(!EN) U13.9(G0) U13.10(G1) U13.11(G2) U13.12(G3) U14.2(V-) U14.3(!EN) U14.9(G0) U14.10(G1) U14.11(G2) U14.12(G3) U15.4(P:V-) U16.4(P:V-) U17.4(V-) U19.4(V-) ; also sheet 1,3,4,5,6,7,8,9
IF_1583MHZ: U11.2(RFA) ; also sheet 1
IFI_N [differential]: R54.1 U11.26(IFIM)
IFI_P [differential]: R53.2 U11.25(IFIP) U17.3(IN)
IFQ_N [differential]: R52.1 U11.15(IFQM)
IFQ_P [differential]: R51.2 U11.16(IFQP) U19.3(IN)
LO_N [differential]: C2.2 C104.1 U11.20(LOM)
LO_P [differential]: C1.2 C112.1 U11.19(LOP)
MCU_SPI3_MISO: R40.1 U11.21(SDO) ; also sheet 1,4
MCU_SPI3_MOSI: R39.1 U11.22(SDI) ; also sheet 1,4
MCU_SPI3_SCLK: R36.1 U11.23(SCK) ; also sheet 1,4
MIXER_CS: U11.17(CSB) ; also sheet 3
N$3: C18.1 U2.1(REF+)
N$4: C17.1 U2.28(REF-)
N$7: C19.1 U2.16(TB) U2.18(CMC) U2.19(CMB) U2.20(CMA)
N$8: C20.1 U2.22(BVCO)
N$9: C22.1 U2.14(BB)
N$10: R31.1 U2.25(VCP+)
N$11: C57.1 U2.7(LDO)
N$12: C68.1 R32.1 U2.26(CP)
N$16: C70.1 R33.1
N$17: C69.1 L4.2 R33.2 U2.15(TUNE)
N$19: L4.1 R32.2
N$22: R35.2 U2.3(!CS)
N$23: R36.2 U2.4(SCLK)
N$24: R39.2 U2.5(SDI)
N$28: R40.2 U2.6(SDO)
N$83: R47.1 R48.2 U16.6(B:-IN)
N$85: R30.1 R42.2 U15.2(A:-IN)
N$86: R44.2 R45.1 U15.6(B:-IN)
N$91: R16.1 R42.1 R44.1 U15.3(A:+IN)
N$92: R16.2 U14.1(OUT)
N$94: R14.2 U13.1(OUT)
N$109: R46.1 R50.2 U16.2(A:-IN)
N$110: R14.1 R48.1 R50.1 U16.3(A:+IN)
N$120: C130.2 L2.1 U11.10(MQM)
N$127: C123.1 L1.2 U11.9(MQP)
N$128: C127.2 L2.2 U11.12(AQM)
N$129: C124.1 L1.1 U11.13(AQP)
N$130: C133.2 L5.2 U11.31(MIM)
N$131: C132.1 L3.1 U11.32(MIP)
N$132: C131.1 L3.2 U11.28(AIP)
N$133: C134.2 L5.1 U11.29(AIM)
N$134: C135.1 C149.1 R55.1 R62.2 U11.6(VCM)
N$206: C18.2 R80.2
POSTMIX_GAIN0: U17.5(G0) U19.5(G0) ; also sheet 3
POSTMIX_GAIN1: U17.6(G1) U19.6(G1) ; also sheet 3
POSTMIX_GAIN2: U17.7(G2) U19.7(G2) ; also sheet 3
REF_10MHZ: R80.1 ; also sheet 1
RF_SW: U11.4(RFSW) ; also sheet 3
SYNTH2_CS: R35.1 ; also sheet 3
SYNTH2_N [differential]: C104.2 L10.1 U2.11(RF-)
SYNTH2_P [differential]: C112.2 L18.1 U2.12(RF+)
Unconnected: U2.2(STAT) U11.3(TEMP) U11.7(RFB) U11.11(DNC) U11.14(DNC) U11.27(DNC) U11.30(DNC)

### Buses
CTRLBUS:POSTMIX_GAIN[0..2],DATA_[0..5],FLT_CS,ATTEN_LE,RF_SW,SYNTH1_CS,SYNTH2_CS,MIXER_CS

### Notes on the sheet
- I-channel,  +/- 10-150 kHz BW, 15 steps
- 8th order LPF, >100dB alt channel rejection
- 2.9MHz 3dB BW
- Note: 90.9 ohm, 270, 4.99k  res should be 0.1% to minimize DC offsets.
- CMV=1.65V, TO 16-BIT ADC
- ADC is 83dB SNR in diff mode.
- V+/2
- 90.9 res for 18mA, for CMV of 1.65V
- N.C. | N.C.
- Q-channel,  +/- 10-150 kHz BW, 15 steps
- VCM=1.65V | 8th order LPF, >100dB alt channel rejection
- N.C. | N.C.
- CMV=1.65V, TO 16-BIT ADC
- ADC is 83dB SNR in diff mode.
- V+/2
- 90.9 res for 18mA, for CMV of 1.65V
- 2.9MHz 3dB BW
- U16 | U15 | U1
- 1583 MHz LO
- t.elliott
- t.elliott

## Sheet 3 of 9
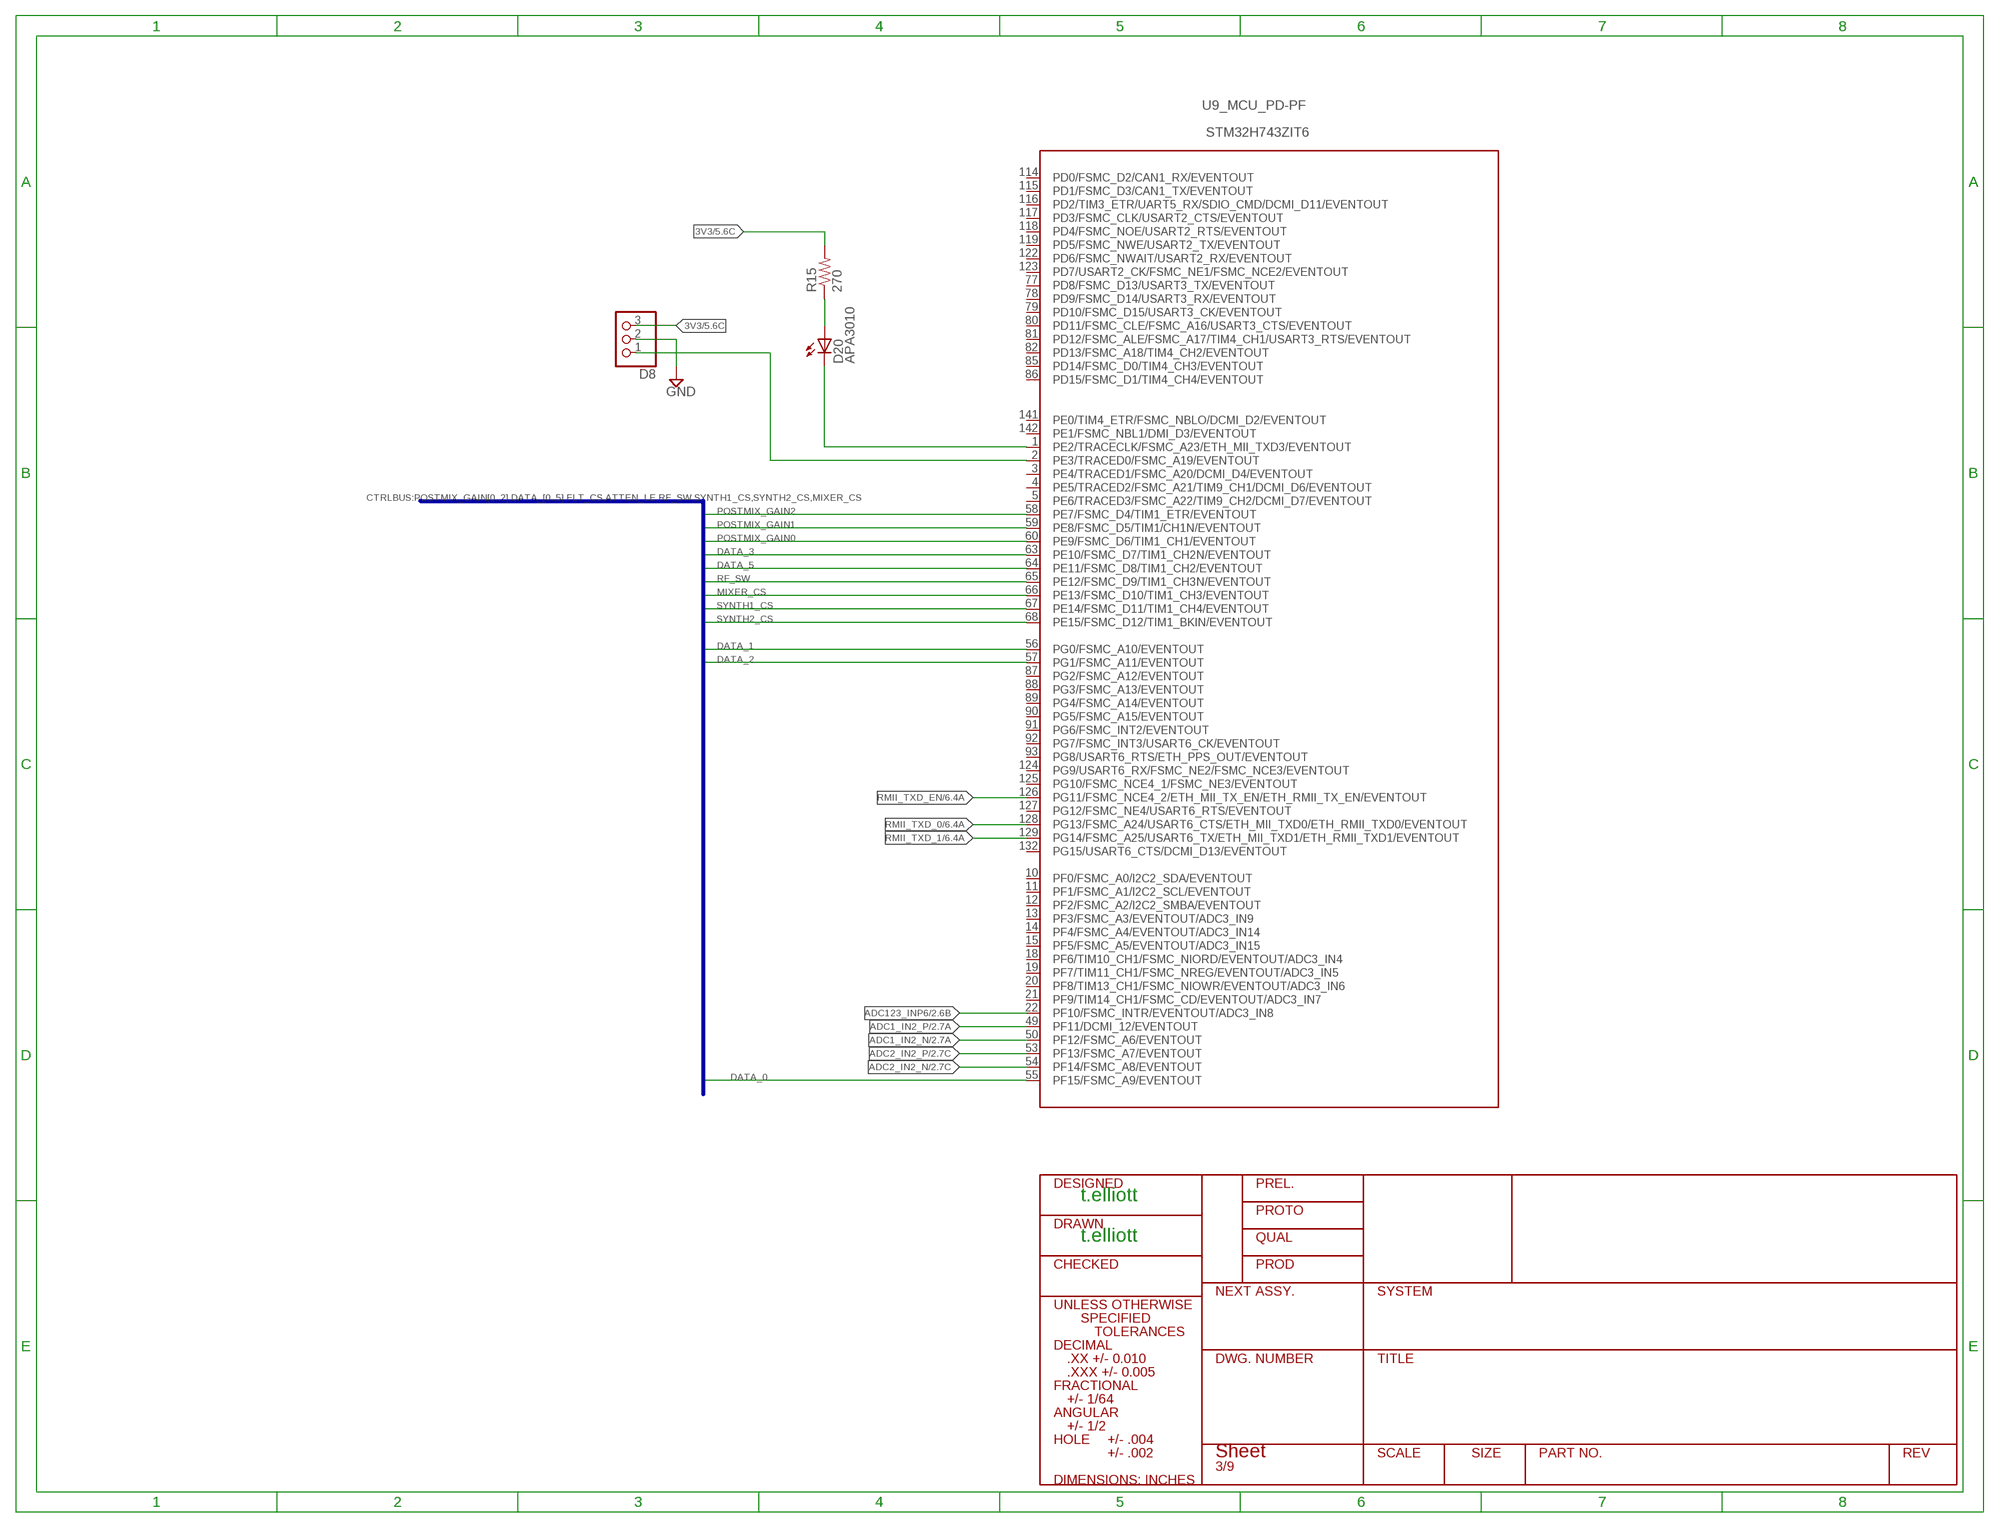
[diagram p4: schematic, sheet 3]

### Parts
D8  PINHD-1X3  [1X03]
D20  APA3010  LED-APA3010_1PRIMARY  [LED-APA3010_1PRIMARY]
R15  270  R-US_R0603  [R0603]
U9  STM32H743ZIT6  STM32F407_144_MG144  [STM32F407_144]

### Nets
3V3: D8.3 R15.2 ; also sheet 5,7,8
ADC1_IN2_N [differential]: U9.50(_MCU_PD-PF:PF12/FSMC_A6/EVENTOUT) ; also sheet 2
ADC1_IN2_P [differential]: U9.49(_MCU_PD-PF:PF11/DCMI_12/EVENTOUT) ; also sheet 2
ADC2_IN2_N [differential]: U9.54(_MCU_PD-PF:PF14/FSMC_A8/EVENTOUT) ; also sheet 2
ADC2_IN2_P [differential]: U9.53(_MCU_PD-PF:PF13/FSMC_A7/EVENTOUT) ; also sheet 2
ADC123_INP6: U9.22(_MCU_PD-PF:PF10/FSMC_INTR/EVENTOUT/ADC3_IN8) ; also sheet 2
DATA_0: U9.55(_MCU_PD-PF:PF15/FSMC_A9/EVENTOUT) ; also sheet 1,2
DATA_1: U9.56(_MCU_PD-PF:PG0/FSMC_A10/EVENTOUT) ; also sheet 1,2
DATA_2: U9.57(_MCU_PD-PF:PG1/FSMC_A11/EVENTOUT) ; also sheet 1,2
DATA_3: U9.63(_MCU_PD-PF:PE10/FSMC_D7/TIM1_CH2N/EVENTOUT) ; also sheet 1,2
DATA_5: U9.64(_MCU_PD-PF:PE11/FSMC_D8/TIM1_CH2/EVENTOUT) ; also sheet 1
GND: D8.2 ; also sheet 1,2,4,5,6,7,8,9
MIXER_CS: U9.66(_MCU_PD-PF:PE13/FSMC_D10/TIM1_CH3/EVENTOUT) ; also sheet 2
N$37: D20.1(C) U9.1(_MCU_PD-PF:PE2/TRACECLK/FSMC_A23/ETH_MII_TXD3/EVENTOUT)
N$38: D8.1 U9.2(_MCU_PD-PF:PE3/TRACED0/FSMC_A19/EVENTOUT)
N$41: D20.2(A) R15.1
POSTMIX_GAIN0: U9.60(_MCU_PD-PF:PE9/FSMC_D6/TIM1_CH1/EVENTOUT) ; also sheet 2
POSTMIX_GAIN1: U9.59(_MCU_PD-PF:PE8/FSMC_D5/TIM1/CH1N/EVENTOUT) ; also sheet 2
POSTMIX_GAIN2: U9.58(_MCU_PD-PF:PE7/FSMC_D4/TIM1_ETR/EVENTOUT) ; also sheet 2
RF_SW: U9.65(_MCU_PD-PF:PE12/FSMC_D9/TIM1_CH3N/EVENTOUT) ; also sheet 2
RMII_TXD_0: U9.128(_MCU_PD-PF:PG13/FSMC_A24/USART6_CTS/ETH_MII_TXD0/ETH_RMII_TXD0/EVENTOUT) ; also sheet 6
RMII_TXD_1: U9.129(_MCU_PD-PF:PG14/FSMC_A25/USART6_TX/ETH_MII_TXD1/ETH_RMII_TXD1/EVENTOUT) ; also sheet 6
RMII_TXD_EN: U9.126(_MCU_PD-PF:PG11/FSMC_NCE4_2/ETH_MII_TX_EN/ETH_RMII_TX_EN/EVENTOUT) ; also sheet 6
SYNTH1_CS: U9.67(_MCU_PD-PF:PE14/FSMC_D11/TIM1_CH4/EVENTOUT) ; also sheet 1
SYNTH2_CS: U9.68(_MCU_PD-PF:PE15/FSMC_D12/TIM1_BKIN/EVENTOUT) ; also sheet 2
Unconnected: U9.3(_MCU_PD-PF:PE4/TRACED1/FSMC_A20/DCMI_D4/EVENTOUT) U9.4(_MCU_PD-PF:PE5/TRACED2/FSMC_A21/TIM9_CH1/DCMI_D6/EVENTOUT) U9.5(_MCU_PD-PF:PE6/TRACED3/FSMC_A22/TIM9_CH2/DCMI_D7/EVENTOUT) U9.10(_MCU_PD-PF:PF0/FSMC_A0/I2C2_SDA/EVENTOUT) U9.11(_MCU_PD-PF:PF1/FSMC_A1/I2C2_SCL/EVENTOUT) U9.12(_MCU_PD-PF:PF2/FSMC_A2/I2C2_SMBA/EVENTOUT) U9.13(_MCU_PD-PF:PF3/FSMC_A3/EVENTOUT/ADC3_IN9) U9.14(_MCU_PD-PF:PF4/FSMC_A4/EVENTOUT/ADC3_IN14) U9.15(_MCU_PD-PF:PF5/FSMC_A5/EVENTOUT/ADC3_IN15) U9.18(_MCU_PD-PF:PF6/TIM10_CH1/FSMC_NIORD/EVENTOUT/ADC3_IN4) U9.19(_MCU_PD-PF:PF7/TIM11_CH1/FSMC_NREG/EVENTOUT/ADC3_IN5) U9.20(_MCU_PD-PF:PF8/TIM13_CH1/FSMC_NIOWR/EVENTOUT/ADC3_IN6) U9.21(_MCU_PD-PF:PF9/TIM14_CH1/FSMC_CD/EVENTOUT/ADC3_IN7) U9.77(_MCU_PD-PF:PD8/FSMC_D13/USART3_TX/EVENTOUT) U9.78(_MCU_PD-PF:PD9/FSMC_D14/USART3_RX/EVENTOUT) U9.79(_MCU_PD-PF:PD10/FSMC_D15/USART3_CK/EVENTOUT) U9.80(_MCU_PD-PF:PD11/FSMC_CLE/FSMC_A16/USART3_CTS/EVENTOUT) U9.81(_MCU_PD-PF:PD12/FSMC_ALE/FSMC_A17/TIM4_CH1/USART3_RTS/EVENTOUT) U9.82(_MCU_PD-PF:PD13/FSMC_A18/TIM4_CH2/EVENTOUT) U9.85(_MCU_PD-PF:PD14/FSMC_D0/TIM4_CH3/EVENTOUT) U9.86(_MCU_PD-PF:PD15/FSMC_D1/TIM4_CH4/EVENTOUT) U9.87(_MCU_PD-PF:PG2/FSMC_A12/EVENTOUT) U9.88(_MCU_PD-PF:PG3/FSMC_A13/EVENTOUT) U9.89(_MCU_PD-PF:PG4/FSMC_A14/EVENTOUT) U9.90(_MCU_PD-PF:PG5/FSMC_A15/EVENTOUT) U9.91(_MCU_PD-PF:PG6/FSMC_INT2/EVENTOUT) U9.92(_MCU_PD-PF:PG7/FSMC_INT3/USART6_CK/EVENTOUT) U9.93(_MCU_PD-PF:PG8/USART6_RTS/ETH_PPS_OUT/EVENTOUT) U9.114(_MCU_PD-PF:PD0/FSMC_D2/CAN1_RX/EVENTOUT) U9.115(_MCU_PD-PF:PD1/FSMC_D3/CAN1_TX/EVENTOUT) U9.116(_MCU_PD-PF:PD2/TIM3_ETR/UART5_RX/SDIO_CMD/DCMI_D11/EVENTOUT) U9.117(_MCU_PD-PF:PD3/FSMC_CLK/USART2_CTS/EVENTOUT) U9.118(_MCU_PD-PF:PD4/FSMC_NOE/USART2_RTS/EVENTOUT) U9.119(_MCU_PD-PF:PD5/FSMC_NWE/USART2_TX/EVENTOUT) U9.122(_MCU_PD-PF:PD6/FSMC_NWAIT/USART2_RX/EVENTOUT) U9.123(_MCU_PD-PF:PD7/USART2_CK/FSMC_NE1/FSMC_NCE2/EVENTOUT) U9.124(_MCU_PD-PF:PG9/USART6_RX/FSMC_NE2/FSMC_NCE3/EVENTOUT) U9.125(_MCU_PD-PF:PG10/FSMC_NCE4_1/FSMC_NE3/EVENTOUT) U9.127(_MCU_PD-PF:PG12/FSMC_NE4/USART6_RTS/EVENTOUT) U9.132(_MCU_PD-PF:PG15/USART6_CTS/DCMI_D13/EVENTOUT) U9.141(_MCU_PD-PF:PE0/TIM4_ETR/FSMC_NBLO/DCMI_D2/EVENTOUT) U9.142(_MCU_PD-PF:PE1/FSMC_NBL1/DMI_D3/EVENTOUT)

### Buses
CTRLBUS:POSTMIX_GAIN[0..2],DATA_[0..5],FLT_CS,ATTEN_LE,RF_SW,SYNTH1_CS,SYNTH2_CS,MIXER_CS

### Notes on the sheet
- t.elliott
- t.elliott

## Sheet 4 of 9
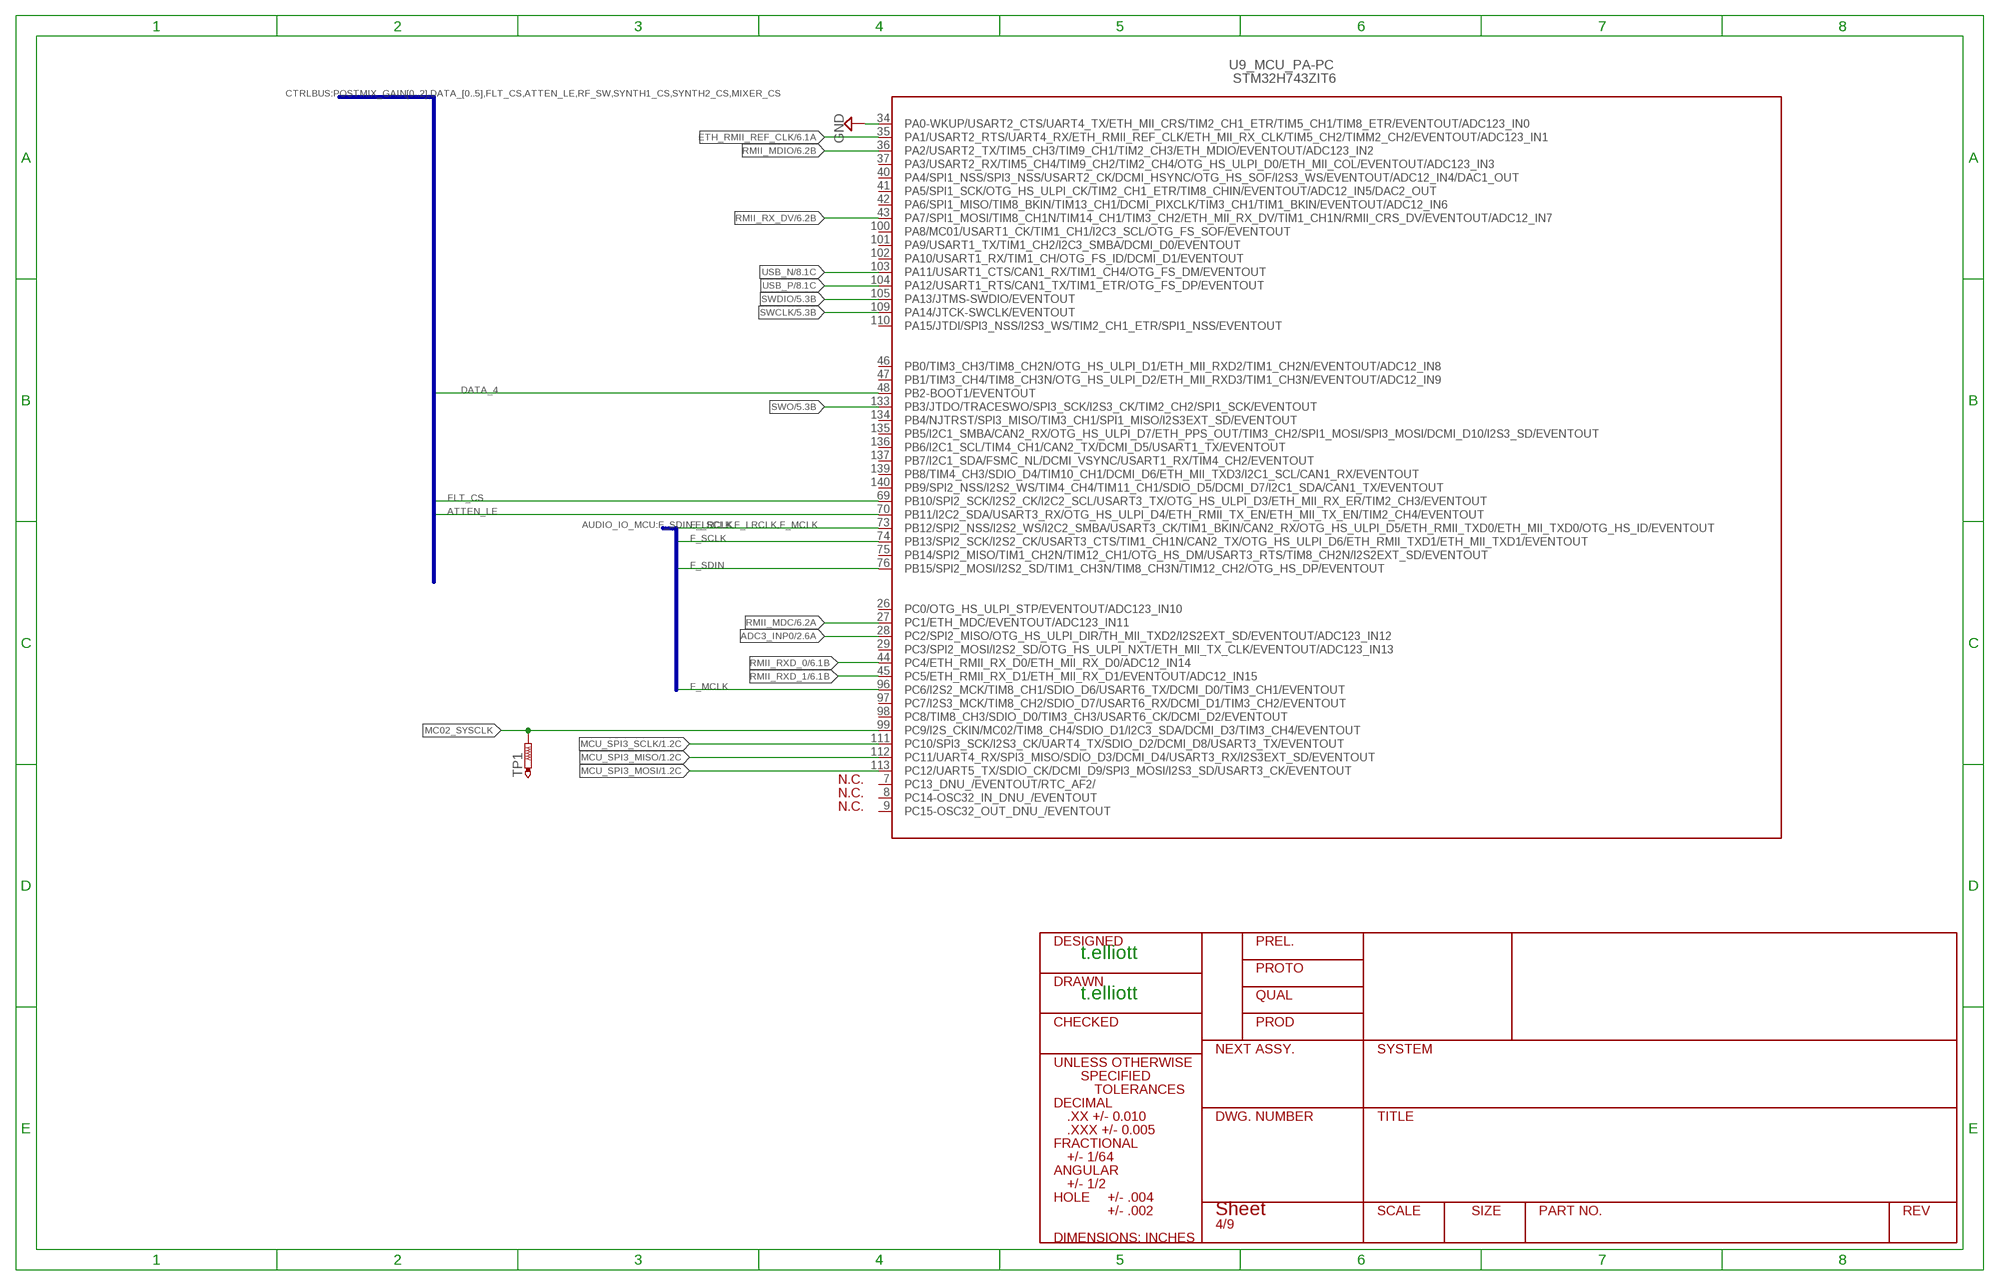
[diagram p5: schematic, sheet 4]

### Parts
TP1  PTR1TP08R  [TP08R]

### Nets
ADC3_INP0: U9.28(_MCU_PA-PC:PC2/SPI2_MISO/OTG_HS_ULPI_DIR/TH_MII_TXD2/I2S2EXT_SD/EVENTOUT/ADC123_IN12) ; also sheet 2
ATTEN_LE: U9.70(_MCU_PA-PC:PB11/I2C2_SDA/USART3_RX/OTG_HS_ULPI_D4/ETH_RMII_TX_EN/ETH_MII_TX_EN/TIM2_CH4/EVENTOUT) ; also sheet 1
DATA_4: U9.48(_MCU_PA-PC:PB2-BOOT1/EVENTOUT) ; also sheet 1
ETH_RMII_REF_CLK: U9.35(_MCU_PA-PC:PA1/USART2_RTS/UART4_RX/ETH_RMII_REF_CLK/ETH_MII_RX_CLK/TIM5_CH2/TIMM2_CH2/EVENTOUT/ADC123_IN1) ; also sheet 6
F_LRCLK: U9.73(_MCU_PA-PC:PB12/SPI2_NSS/I2S2_WS/I2C2_SMBA/USART3_CK/TIM1_BKIN/CAN2_RX/OTG_HS_ULPI_D5/ETH_RMII_TXD0/ETH_MII_TXD0/OTG_HS_ID/EVENTOUT) ; also sheet 7
F_MCLK: U9.96(_MCU_PA-PC:PC6/I2S2_MCK/TIM8_CH1/SDIO_D6/USART6_TX/DCMI_D0/TIM3_CH1/EVENTOUT) ; also sheet 7
F_SCLK: U9.74(_MCU_PA-PC:PB13/SPI2_SCK/I2S2_CK/USART3_CTS/TIM1_CH1N/CAN2_TX/OTG_HS_ULPI_D6/ETH_RMII_TXD1/ETH_MII_TXD1/EVENTOUT) ; also sheet 7
F_SDIN: U9.76(_MCU_PA-PC:PB15/SPI2_MOSI/I2S2_SD/TIM1_CH3N/TIM8_CH3N/TIM12_CH2/OTG_HS_DP/EVENTOUT) ; also sheet 7
FLT_CS: U9.69(_MCU_PA-PC:PB10/SPI2_SCK/I2S2_CK/I2C2_SCL/USART3_TX/OTG_HS_ULPI_D3/ETH_MII_RX_ER/TIM2_CH3/EVENTOUT) ; also sheet 2
GND: U9.34(_MCU_PA-PC:PA0-WKUP/USART2_CTS/UART4_TX/ETH_MII_CRS/TIM2_CH1_ETR/TIM5_CH1/TIM8_ETR/EVENTOUT/ADC123_IN0) ; also sheet 1,2,3,5,6,7,8,9
MC02_SYSCLK: TP1.TP U9.99(_MCU_PA-PC:PC9/I2S_CKIN/MC02/TIM8_CH4/SDIO_D1/I2C3_SDA/DCMI_D3/TIM3_CH4/EVENTOUT)
MCU_SPI3_MISO: U9.112(_MCU_PA-PC:PC11/UART4_RX/SPI3_MISO/SDIO_D3/DCMI_D4/USART3_RX/I2S3EXT_SD/EVENTOUT) ; also sheet 1,2
MCU_SPI3_MOSI: U9.113(_MCU_PA-PC:PC12/UART5_TX/SDIO_CK/DCMI_D9/SPI3_MOSI/I2S3_SD/USART3_CK/EVENTOUT) ; also sheet 1,2
MCU_SPI3_SCLK: U9.111(_MCU_PA-PC:PC10/SPI3_SCK/I2S3_CK/UART4_TX/SDIO_D2/DCMI_D8/USART3_TX/EVENTOUT) ; also sheet 1,2
RMII_MDC: U9.27(_MCU_PA-PC:PC1/ETH_MDC/EVENTOUT/ADC123_IN11) ; also sheet 6
RMII_MDIO: U9.36(_MCU_PA-PC:PA2/USART2_TX/TIM5_CH3/TIM9_CH1/TIM2_CH3/ETH_MDIO/EVENTOUT/ADC123_IN2) ; also sheet 6
RMII_RX_DV: U9.43(_MCU_PA-PC:PA7/SPI1_MOSI/TIM8_CH1N/TIM14_CH1/TIM3_CH2/ETH_MII_RX_DV/TIM1_CH1N/RMII_CRS_DV/EVENTOUT/ADC12_IN7) ; also sheet 6
RMII_RXD_0: U9.44(_MCU_PA-PC:PC4/ETH_RMII_RX_D0/ETH_MII_RX_D0/ADC12_IN14) ; also sheet 6
RMII_RXD_1: U9.45(_MCU_PA-PC:PC5/ETH_RMII_RX_D1/ETH_MII_RX_D1/EVENTOUT/ADC12_IN15) ; also sheet 6
SWCLK: U9.109(_MCU_PA-PC:PA14/JTCK-SWCLK/EVENTOUT) ; also sheet 5
SWDIO: U9.105(_MCU_PA-PC:PA13/JTMS-SWDIO/EVENTOUT) ; also sheet 5
SWO: U9.133(_MCU_PA-PC:PB3/JTDO/TRACESWO/SPI3_SCK/I2S3_CK/TIM2_CH2/SPI1_SCK/EVENTOUT) ; also sheet 5
USB_N [differential]: U9.103(_MCU_PA-PC:PA11/USART1_CTS/CAN1_RX/TIM1_CH4/OTG_FS_DM/EVENTOUT) ; also sheet 8
USB_P [differential]: U9.104(_MCU_PA-PC:PA12/USART1_RTS/CAN1_TX/TIM1_ETR/OTG_FS_DP/EVENTOUT) ; also sheet 8
Unconnected: U9.7(_MCU_PA-PC:PC13_DNU_/EVENTOUT/RTC_AF2/) U9.8(_MCU_PA-PC:PC14-OSC32_IN_DNU_/EVENTOUT) U9.9(_MCU_PA-PC:PC15-OSC32_OUT_DNU_/EVENTOUT) U9.26(_MCU_PA-PC:PC0/OTG_HS_ULPI_STP/EVENTOUT/ADC123_IN10) U9.29(_MCU_PA-PC:PC3/SPI2_MOSI/I2S2_SD/OTG_HS_ULPI_NXT/ETH_MII_TX_CLK/EVENTOUT/ADC123_IN13) U9.37(_MCU_PA-PC:PA3/USART2_RX/TIM5_CH4/TIM9_CH2/TIM2_CH4/OTG_HS_ULPI_D0/ETH_MII_COL/EVENTOUT/ADC123_IN3) U9.40(_MCU_PA-PC:PA4/SPI1_NSS/SPI3_NSS/USART2_CK/DCMI_HSYNC/OTG_HS_SOF/I2S3_WS/EVENTOUT/ADC12_IN4/DAC1_OUT) U9.41(_MCU_PA-PC:PA5/SPI1_SCK/OTG_HS_ULPI_CK/TIM2_CH1_ETR/TIM8_CHIN/EVENTOUT/ADC12_IN5/DAC2_OUT) U9.42(_MCU_PA-PC:PA6/SPI1_MISO/TIM8_BKIN/TIM13_CH1/DCMI_PIXCLK/TIM3_CH1/TIM1_BKIN/EVENTOUT/ADC12_IN6) U9.46(_MCU_PA-PC:PB0/TIM3_CH3/TIM8_CH2N/OTG_HS_ULPI_D1/ETH_MII_RXD2/TIM1_CH2N/EVENTOUT/ADC12_IN8) U9.47(_MCU_PA-PC:PB1/TIM3_CH4/TIM8_CH3N/OTG_HS_ULPI_D2/ETH_MII_RXD3/TIM1_CH3N/EVENTOUT/ADC12_IN9) U9.75(_MCU_PA-PC:PB14/SPI2_MISO/TIM1_CH2N/TIM12_CH1/OTG_HS_DM/USART3_RTS/TIM8_CH2N/I2S2EXT_SD/EVENTOUT) U9.97(_MCU_PA-PC:PC7/I2S3_MCK/TIM8_CH2/SDIO_D7/USART6_RX/DCMI_D1/TIM3_CH2/EVENTOUT) U9.98(_MCU_PA-PC:PC8/TIM8_CH3/SDIO_D0/TIM3_CH3/USART6_CK/DCMI_D2/EVENTOUT) U9.100(_MCU_PA-PC:PA8/MC01/USART1_CK/TIM1_CH1/I2C3_SCL/OTG_FS_SOF/EVENTOUT) U9.101(_MCU_PA-PC:PA9/USART1_TX/TIM1_CH2/I2C3_SMBA/DCMI_D0/EVENTOUT) U9.102(_MCU_PA-PC:PA10/USART1_RX/TIM1_CH/OTG_FS_ID/DCMI_D1/EVENTOUT) U9.110(_MCU_PA-PC:PA15/JTDI/SPI3_NSS/I2S3_WS/TIM2_CH1_ETR/SPI1_NSS/EVENTOUT) U9.134(_MCU_PA-PC:PB4/NJTRST/SPI3_MISO/TIM3_CH1/SPI1_MISO/I2S3EXT_SD/EVENTOUT) U9.135(_MCU_PA-PC:PB5/I2C1_SMBA/CAN2_RX/OTG_HS_ULPI_D7/ETH_PPS_OUT/TIM3_CH2/SPI1_MOSI/SPI3_MOSI/DCMI_D10/I2S3_SD/EVENTOUT) U9.136(_MCU_PA-PC:PB6/I2C1_SCL/TIM4_CH1/CAN2_TX/DCMI_D5/USART1_TX/EVENTOUT) U9.137(_MCU_PA-PC:PB7/I2C1_SDA/FSMC_NL/DCMI_VSYNC/USART1_RX/TIM4_CH2/EVENTOUT) U9.139(_MCU_PA-PC:PB8/TIM4_CH3/SDIO_D4/TIM10_CH1/DCMI_D6/ETH_MII_TXD3/I2C1_SCL/CAN1_RX/EVENTOUT) U9.140(_MCU_PA-PC:PB9/SPI2_NSS/I2S2_WS/TIM4_CH4/TIM11_CH1/SDIO_D5/DCMI_D7/I2C1_SDA/CAN1_TX/EVENTOUT)

### Buses
AUDIO_IO_MCU:F_SDIN,F_SCLK,F_LRCLK,F_MCLK
CTRLBUS:POSTMIX_GAIN[0..2],DATA_[0..5],FLT_CS,ATTEN_LE,RF_SW,SYNTH1_CS,SYNTH2_CS,MIXER_CS

### Notes on the sheet
- t.elliott
- t.elliott

## Sheet 5 of 9
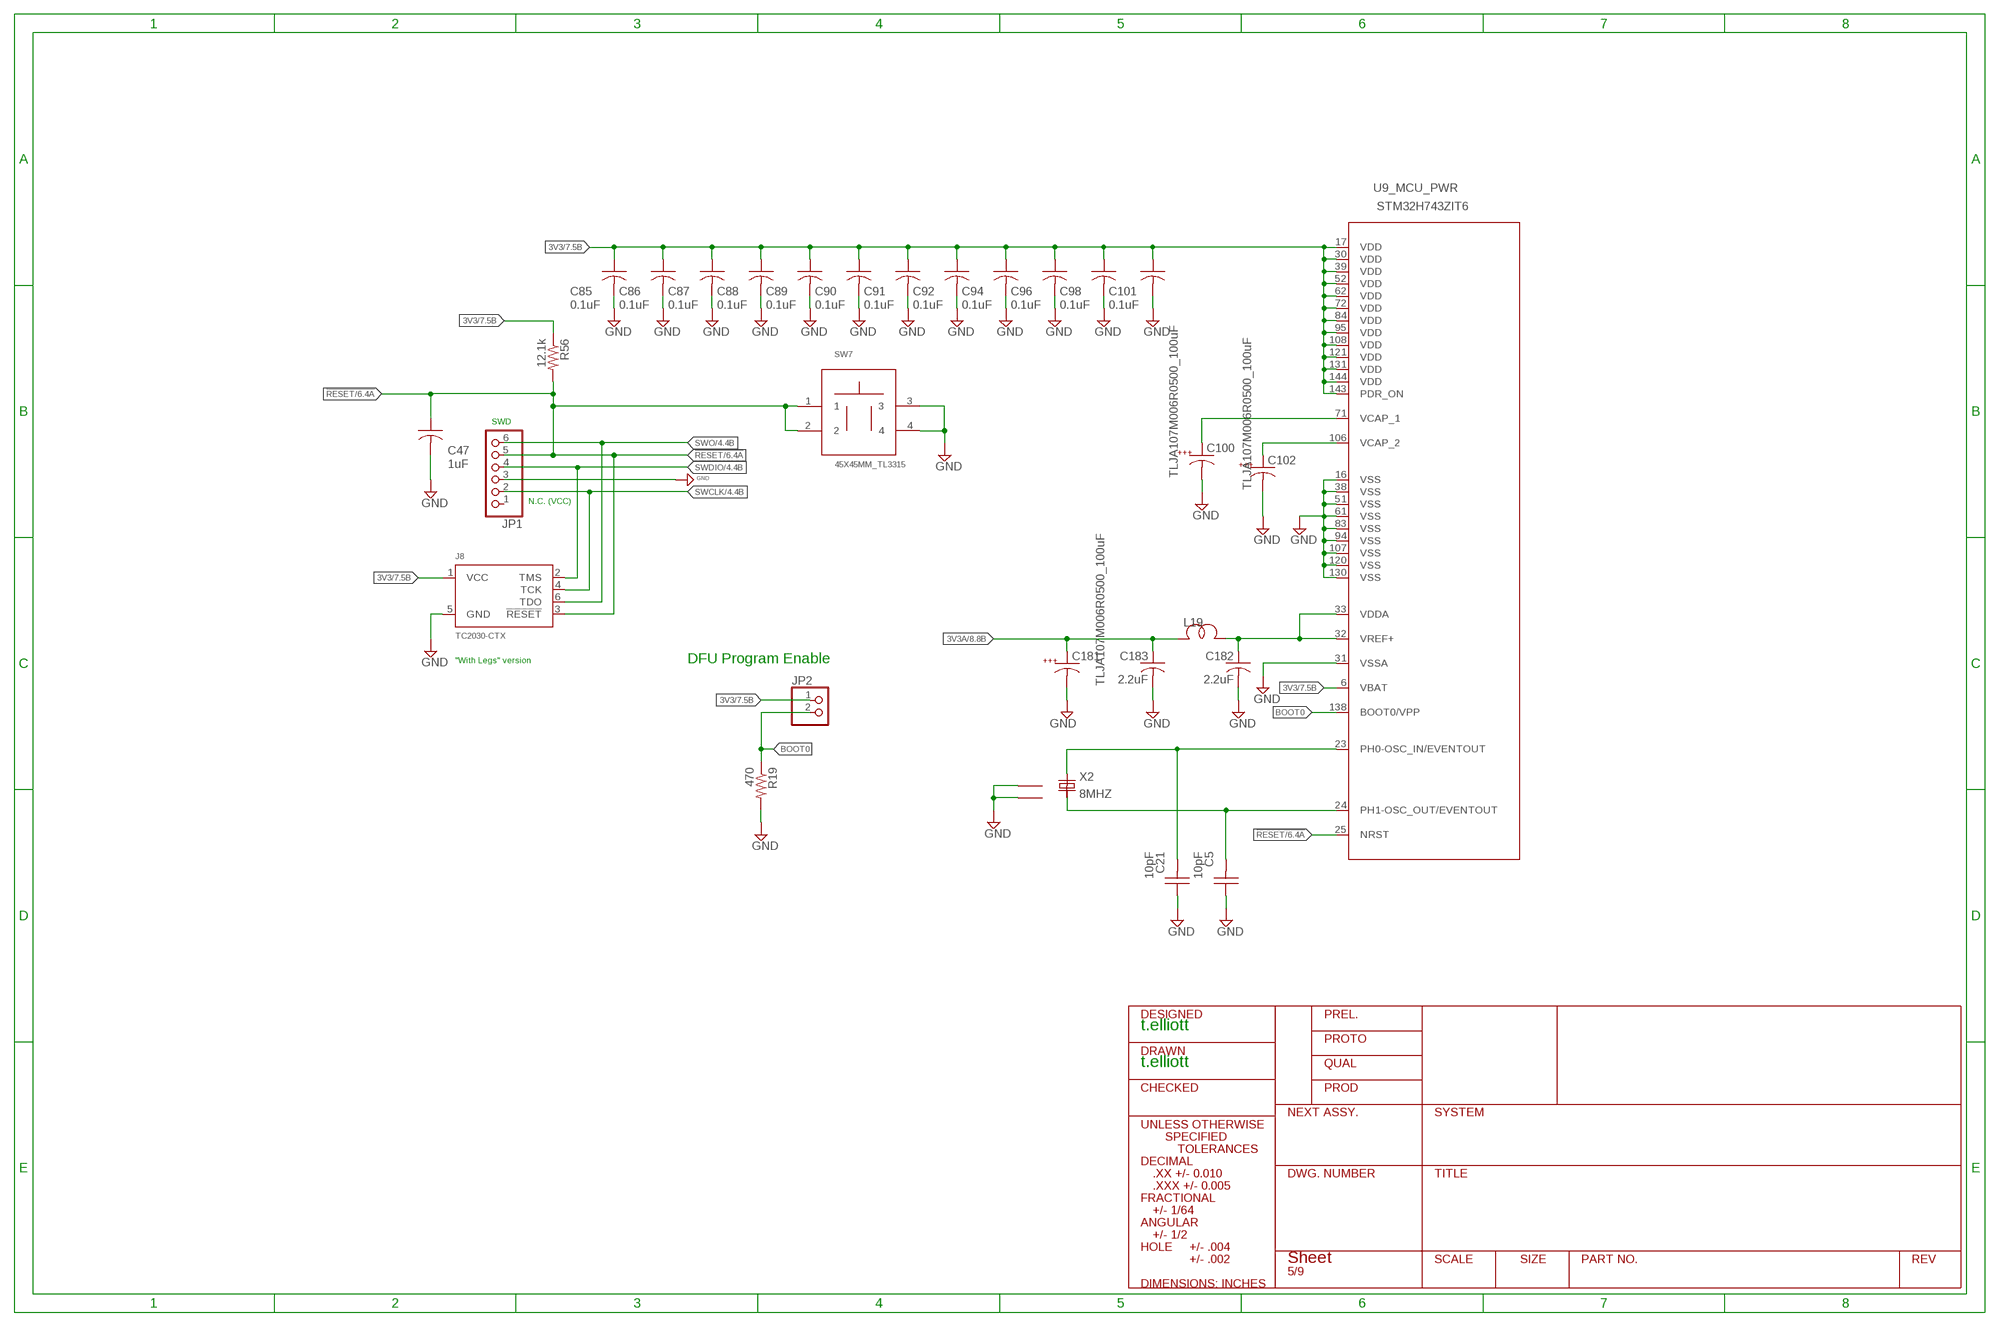
[diagram p6: schematic, sheet 5]

### Parts
C5  10pF  C-USC0402  [C0402]
C21  10pF  C-USC0402  [C0402]
C47  1uF  CAPACITOR0402  [0402]
C85  0.1uF  CAPACITOR0402  [0402]
C86  0.1uF  CAPACITOR0402  [0402]
C87  0.1uF  CAPACITOR0402  [0402]
C88  0.1uF  CAPACITOR0402  [0402]
C89  0.1uF  CAPACITOR0402  [0402]
C90  0.1uF  CAPACITOR0402  [0402]
C91  0.1uF  CAPACITOR0402  [0402]
C92  0.1uF  CAPACITOR0402  [0402]
C94  0.1uF  CAPACITOR0402  [0402]
C96  0.1uF  CAPACITOR0402  [0402]
C98  0.1uF  CAPACITOR0402  [0402]
C100  TLJA107M006R0500_100uF  CAPACITOR1210K  [1210K]
C101  0.1uF  CAPACITOR0402  [0402]
C102  TLJA107M006R0500_100uF  CAPACITOR1210K  [1210K]
C181  TLJA107M006R0500_100uF  CAPACITOR1210K  [1210K]
C182  2.2uF  C-USC0805  [C0805]
C183  2.2uF  C-USC0805  [C0805]
J8  TC2030-CTX  [TC2030-IDC]
JP1  PINHD-1X6  [1X06]
JP2  PINHD-1X2  [1X02]
L19  WE-CBF_0603  [0603]
R19  470  R-US_R0402  [R0402]
R56  12.1k  R-US_R0603  [R0603]
SW7  45X45MM_TL3315  [PBUT_SW_TACTILE_4_5MMX4_5MM]
X2  8MHZ  ECS-250-20-30B-DUDU  [ECS-250-20-30B-DU_CRYSTAL]

### Nets
3V3: C85.1(A) C86.1(A) C87.1(A) C88.1(A) C89.1(A) C90.1(A) C91.1(A) C92.1(A) C94.1(A) C96.1(A) C98.1(A) C101.1(A) J8.1(VCC) JP2.1 R56.1 U9.6(_MCU_PWR:VBAT) U9.17(_MCU_PWR:VDD) U9.30(_MCU_PWR:VDD) U9.39(_MCU_PWR:VDD) U9.52(_MCU_PWR:VDD) U9.62(_MCU_PWR:VDD) U9.72(_MCU_PWR:VDD) U9.84(_MCU_PWR:VDD) U9.95(_MCU_PWR:VDD) U9.108(_MCU_PWR:VDD) U9.121(_MCU_PWR:VDD) U9.131(_MCU_PWR:VDD) U9.143(_MCU_PWR:PDR_ON) U9.144(_MCU_PWR:VDD) ; also sheet 3,7,8
3V3A: C181.A C183.1 L19.1 ; also sheet 1,2,8
20MHZ_REF: C21.2 U9.23(_MCU_PWR:PH0-OSC_IN/EVENTOUT) X2.1
!RESET: C47.1(A) J8.3(!RESET) JP1.5 R56.2 SW7.1 SW7.2 U9.25(_MCU_PWR:NRST) ; also sheet 6
BOOT0: JP2.2 R19.1 U9.138(_MCU_PWR:BOOT0/VPP)
GND: C5.1 C21.1 C47.2(C) C85.2(C) C86.2(C) C87.2(C) C88.2(C) C89.2(C) C90.2(C) C91.2(C) C92.2(C) C94.2(C) C96.2(C) C98.2(C) C100.C C101.2(C) C102.C C181.C C182.2 C183.2 J8.5(GND) JP1.3 R19.2 SW7.3 SW7.4 U9.16(_MCU_PWR:VSS) U9.31(_MCU_PWR:VSSA) U9.38(_MCU_PWR:VSS) U9.51(_MCU_PWR:VSS) U9.61(_MCU_PWR:VSS) U9.83(_MCU_PWR:VSS) U9.94(_MCU_PWR:VSS) U9.107(_MCU_PWR:VSS) U9.120(_MCU_PWR:VSS) U9.130(_MCU_PWR:VSS) X2.GND@1 X2.GND@2 ; also sheet 1,2,3,4,6,7,8,9
N$25: C182.1 L19.2 U9.32(_MCU_PWR:VREF+) U9.33(_MCU_PWR:VDDA)
N$30: C102.A U9.106(_MCU_PWR:VCAP_2)
N$35: C100.A U9.71(_MCU_PWR:VCAP_1)
SWCLK: J8.4(TCK) JP1.2 ; also sheet 4
SWDIO: J8.2(TMS) JP1.4 ; also sheet 4
SWO: J8.6(TDO) JP1.6 ; also sheet 4
X2: C5.2 U9.24(_MCU_PWR:PH1-OSC_OUT/EVENTOUT) X2.3
Unconnected: JP1.1

### Notes on the sheet
- SWD
- N.C. (VCC)
- "With Legs" version | DFU Program Enable
- t.elliott
- t.elliott

## Sheet 6 of 9
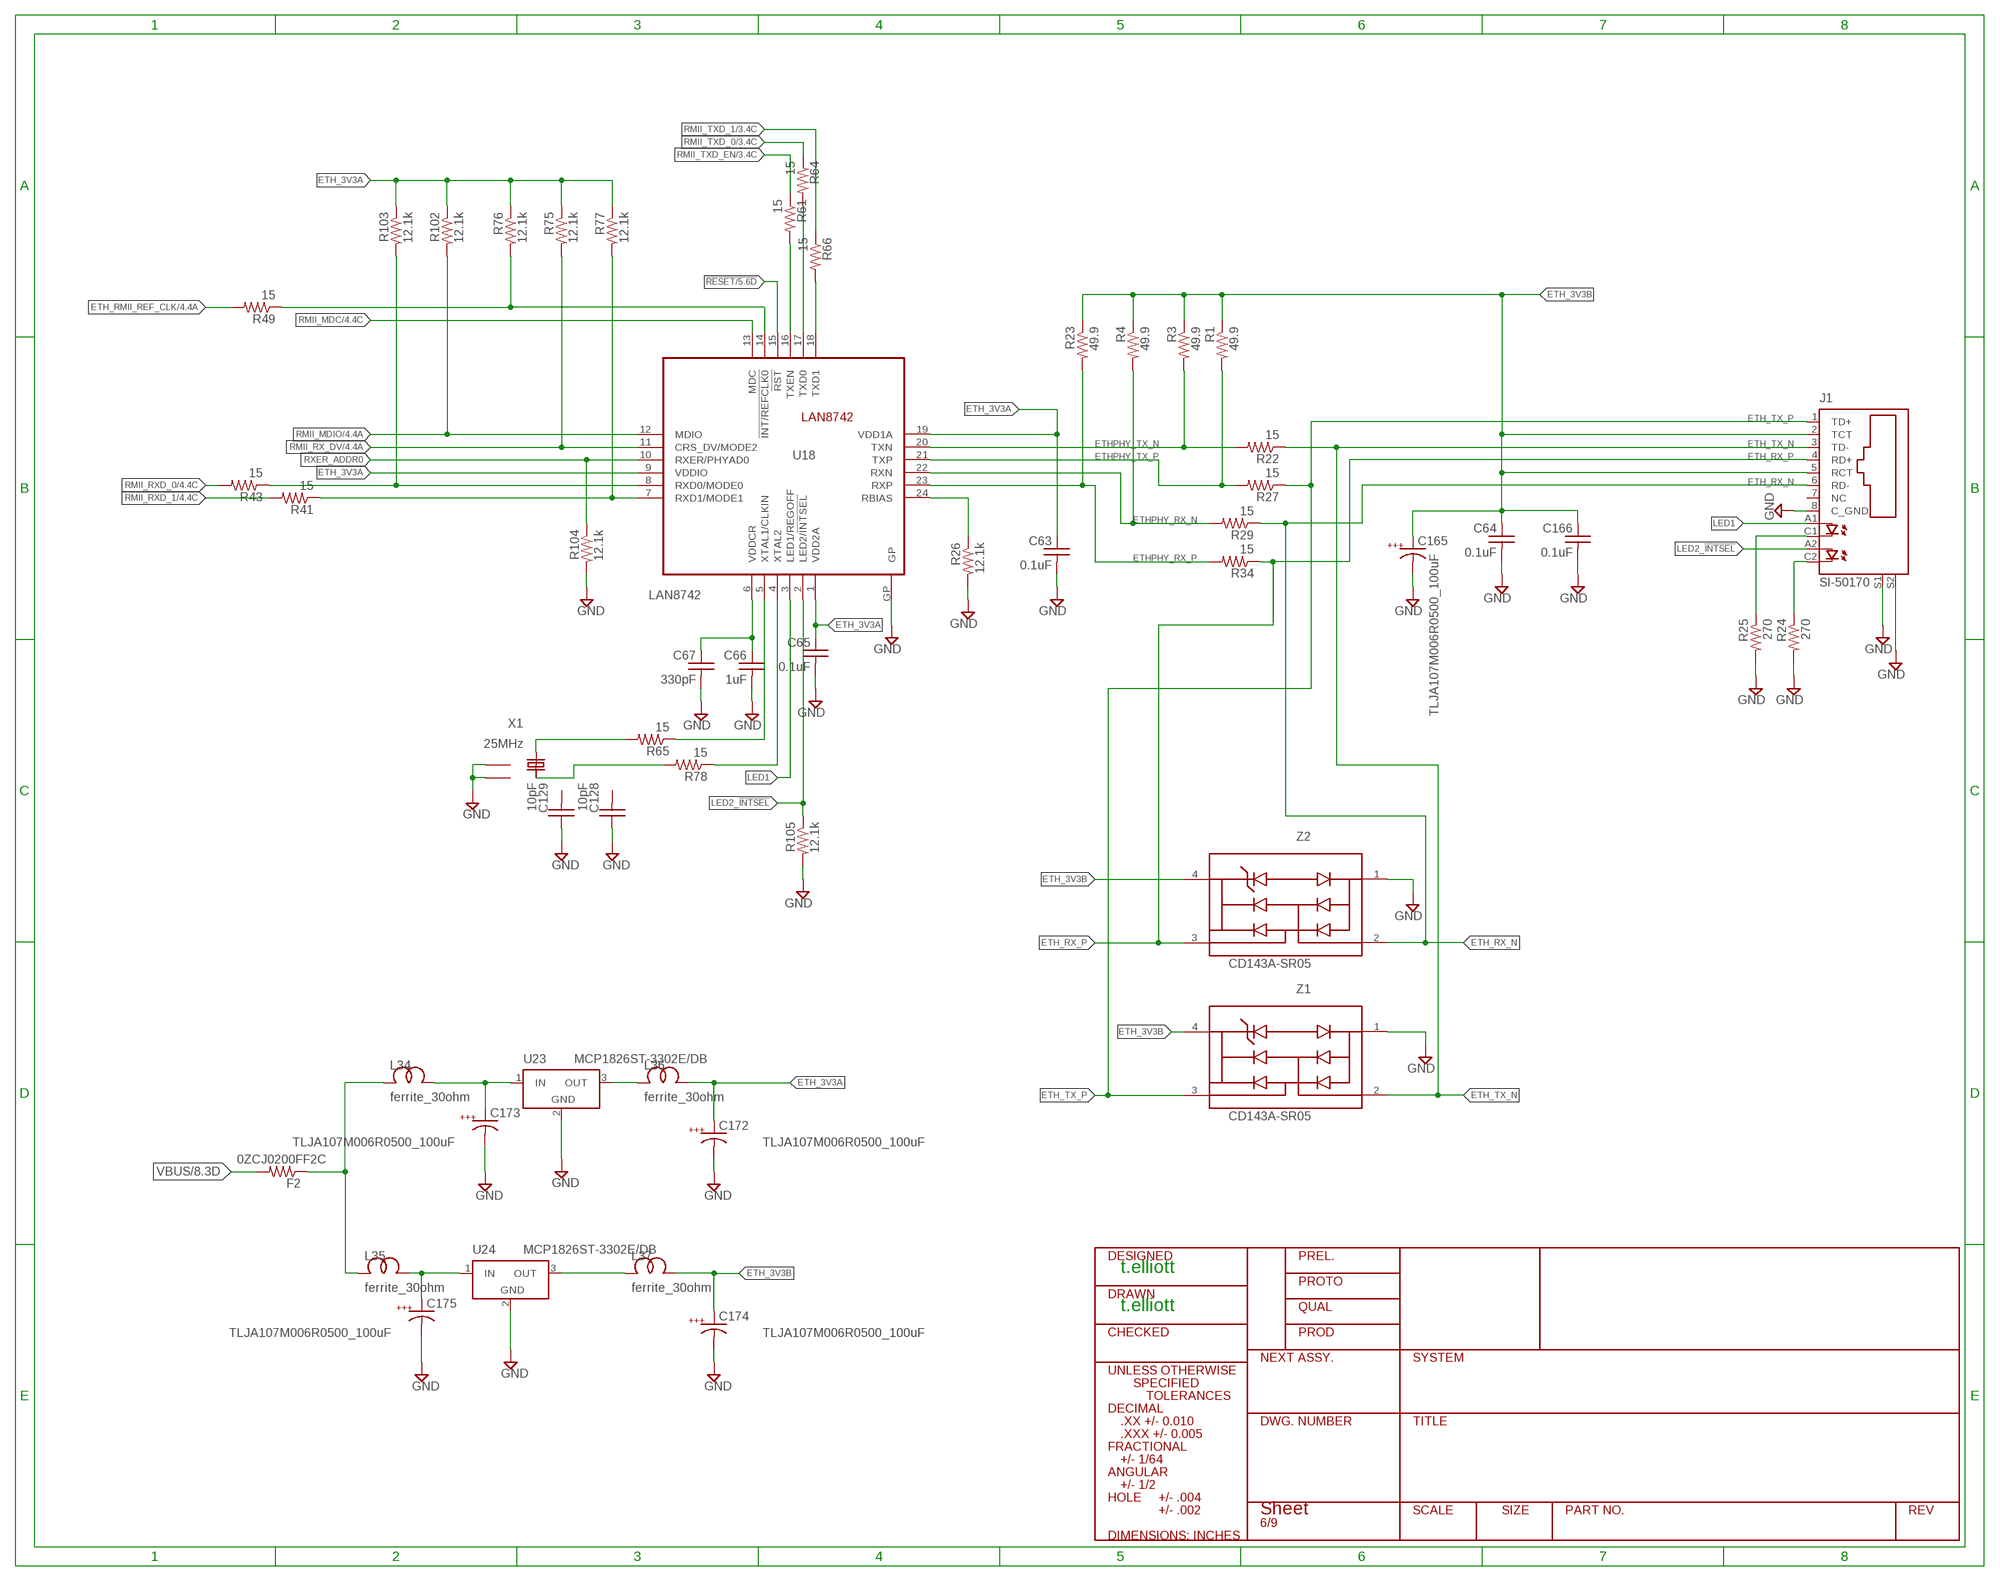
[diagram p7: schematic, sheet 6]

### Parts
C63  0.1uF  C-USC0603  [C0603]
C64  0.1uF  C-USC0603  [C0603]
C65  0.1uF  C-USC0603  [C0603]
C66  1uF  C-USC0603  [C0603]
C67  330pF  C-USC0603  [C0603]
C128  10pF  C-USC0402  [C0402]
C129  10pF  C-USC0402  [C0402]
C165  TLJA107M006R0500_100uF  CAPACITOR1210K  [1210K]
C166  0.1uF  C-USC0603  [C0603]
C172  TLJA107M006R0500_100uF  CAPACITOR1210K  [1210K]
C173  TLJA107M006R0500_100uF  CAPACITOR1210K  [1210K]
C174  TLJA107M006R0500_100uF  CAPACITOR1210K  [1210K]
C175  TLJA107M006R0500_100uF  CAPACITOR1210K  [1210K]
F2  0ZCJ0200FF2C  R-US_R1206  [R1206]
J1  SI-50170  [SI-50170]
L34  ferrite_30ohm  WE-CBF_0603  [0603]
L35  ferrite_30ohm  WE-CBF_0603  [0603]
L36  ferrite_30ohm  WE-CBF_0603  [0603]
L37  ferrite_30ohm  WE-CBF_0603  [0603]
R1  49.9  R-US_R0603  [R0603]
R3  49.9  R-US_R0603  [R0603]
R4  49.9  R-US_R0603  [R0603]
R22  15  R-US_R0402  [R0402]
R23  49.9  R-US_R0603  [R0603]
R24  270  R-US_R0603  [R0603]
R25  270  R-US_R0603  [R0603]
R26  12.1k  R-US_R0603  [R0603]
R27  15  R-US_R0402  [R0402]
R29  15  R-US_R0402  [R0402]
R34  15  R-US_R0402  [R0402]
R41  15  R-US_R0402  [R0402]
R43  15  R-US_R0402  [R0402]
R49  15  R-US_R0402  [R0402]
R61  15  R-US_R0402  [R0402]
R64  15  R-US_R0402  [R0402]
R65  15  R-US_R0402  [R0402]
R66  15  R-US_R0402  [R0402]
R75  12.1k  R-US_R0603  [R0603]
R76  12.1k  R-US_R0603  [R0603]
R77  12.1k  R-US_R0603  [R0603]
R78  15  R-US_R0402  [R0402]
R102  12.1k  R-US_R0603  [R0603]
R103  12.1k  R-US_R0603  [R0603]
R104  12.1k  R-US_R0603  [R0603]
R105  12.1k  R-US_R0603  [R0603]
U18  LAN8742  [QFN-24]
U23  MCP1826ST-3302E/DB  LT1129CST5  [SOT223]
U24  MCP1826ST-3302E/DB  LT1129CST5  [SOT223]
X1  25MHz  ECS-250-20-30B-DUDU  [ECS-250-20-30B-DU_CRYSTAL]
Z1  CD143A-SR05  SR2.8_TVS  [SR2.8.TCT_1PRIMARY]
Z2  CD143A-SR05  SR2.8_TVS  [SR2.8.TCT_1PRIMARY]

### Nets
!RESET: U18.15(!RST) ; also sheet 5
ETH_3V3A: C63.1 C65.1 C172.A L36.2 R75.1 R76.1 R77.1 R102.1 R103.1 U18.1(VDD2A) U18.9(VDDIO) U18.19(VDD1A)
ETH_3V3B: C64.1 C165.A C166.1 C174.A J1.2(TCT) J1.5(RCT) L37.2 R1.1 R3.1 R4.1 R23.1 Z1.4(REF) Z2.4(REF)
ETH_RMII_REF_CLK: R49.2 ; also sheet 4
ETH_RX_N [differential]: J1.6(RD-) R29.1 Z2.2(I/O)
ETH_RX_P [differential]: J1.4(RD+) R34.1 Z2.3(I/O)
ETH_TX_N [differential]: J1.3(TD-) R22.1 Z1.2(I/O)
ETH_TX_P [differential]: J1.1(TD+) R27.1 Z1.3(I/O)
ETH_VIN: F2.1 L34.1 L35.1
ETHPHY_RX_N [differential]: R4.2 R29.2 U18.22(RXN)
ETHPHY_RX_P [differential]: R23.2 R34.2 U18.23(RXP)
ETHPHY_TX_N [differential]: R3.2 R22.2 U18.20(TXN)
ETHPHY_TX_P [differential]: R1.2 R27.2 U18.21(TXP)
GND: C63.2 C64.2 C65.2 C66.2 C67.2 C128.1 C129.1 C165.C C166.2 C172.C C173.C C174.C C175.C J1.8(C_GND) J1.S1 J1.S2 R24.2 R25.2 R26.2 R104.2 R105.2 U18.GP U23.2(GND) U24.2(GND) X1.GND@1 X1.GND@2 Z1.1(GND) Z2.1(GND) ; also sheet 1,2,3,4,5,7,8,9
LED1: J1.A1(A) U18.3(LED1/REGOFF)
LED2_!INTSEL: J1.A2(A1) R105.1 U18.2(LED2/!INTSEL)
N$46: C173.A L34.2 U23.1(IN)
N$96: R26.1 U18.24(RBIAS)
N$98: C66.1 C67.1 U18.6(VDDCR)
N$99: J1.C2(C1) R24.1
N$100: J1.C1(C) R25.1
N$114: R78.1 U18.4(XTAL2)
N$115: R65.1 U18.5(XTAL1/CLKIN)
N$196: C175.A L35.2 U24.1(IN)
N$197: L37.1 U24.3(OUT)
N$198: L36.1 U23.3(OUT)
N$203: R78.2 X1.3
N$204: R65.2 X1.1
REF_CLK: R49.1 R76.2 U18.14(!INT/REFCLK0)
RMII_MDC: U18.13(MDC) ; also sheet 4
RMII_MDIO: R102.2 U18.12(MDIO) ; also sheet 4
RMII_RX_DV: R75.2 U18.11(CRS_DV/MODE2) ; also sheet 4
RMII_RXD_0: R43.2 ; also sheet 4
RMII_RXD_1: R41.2 ; also sheet 4
RMII_TXD_0: R64.1 ; also sheet 3
RMII_TXD_1: R66.1 ; also sheet 3
RMII_TXD_EN: R61.1 ; also sheet 3
RXD0: R43.1 R103.2 U18.8(RXD0/MODE0)
RXD1: R41.1 R77.2 U18.7(RXD1/MODE1)
RXER_ADDR0: R104.1 U18.10(RXER/PHYAD0)
TXD0: R64.2 U18.17(TXD0)
TXD1: R66.2 U18.18(TXD1)
TXEN: R61.2 U18.16(TXEN)
VBUS: F2.2 ; also sheet 8
Unconnected: C128.2 C129.2 J1.7(NC)

### Notes on the sheet
- t.elliott
- t.elliott

## Sheet 7 of 9
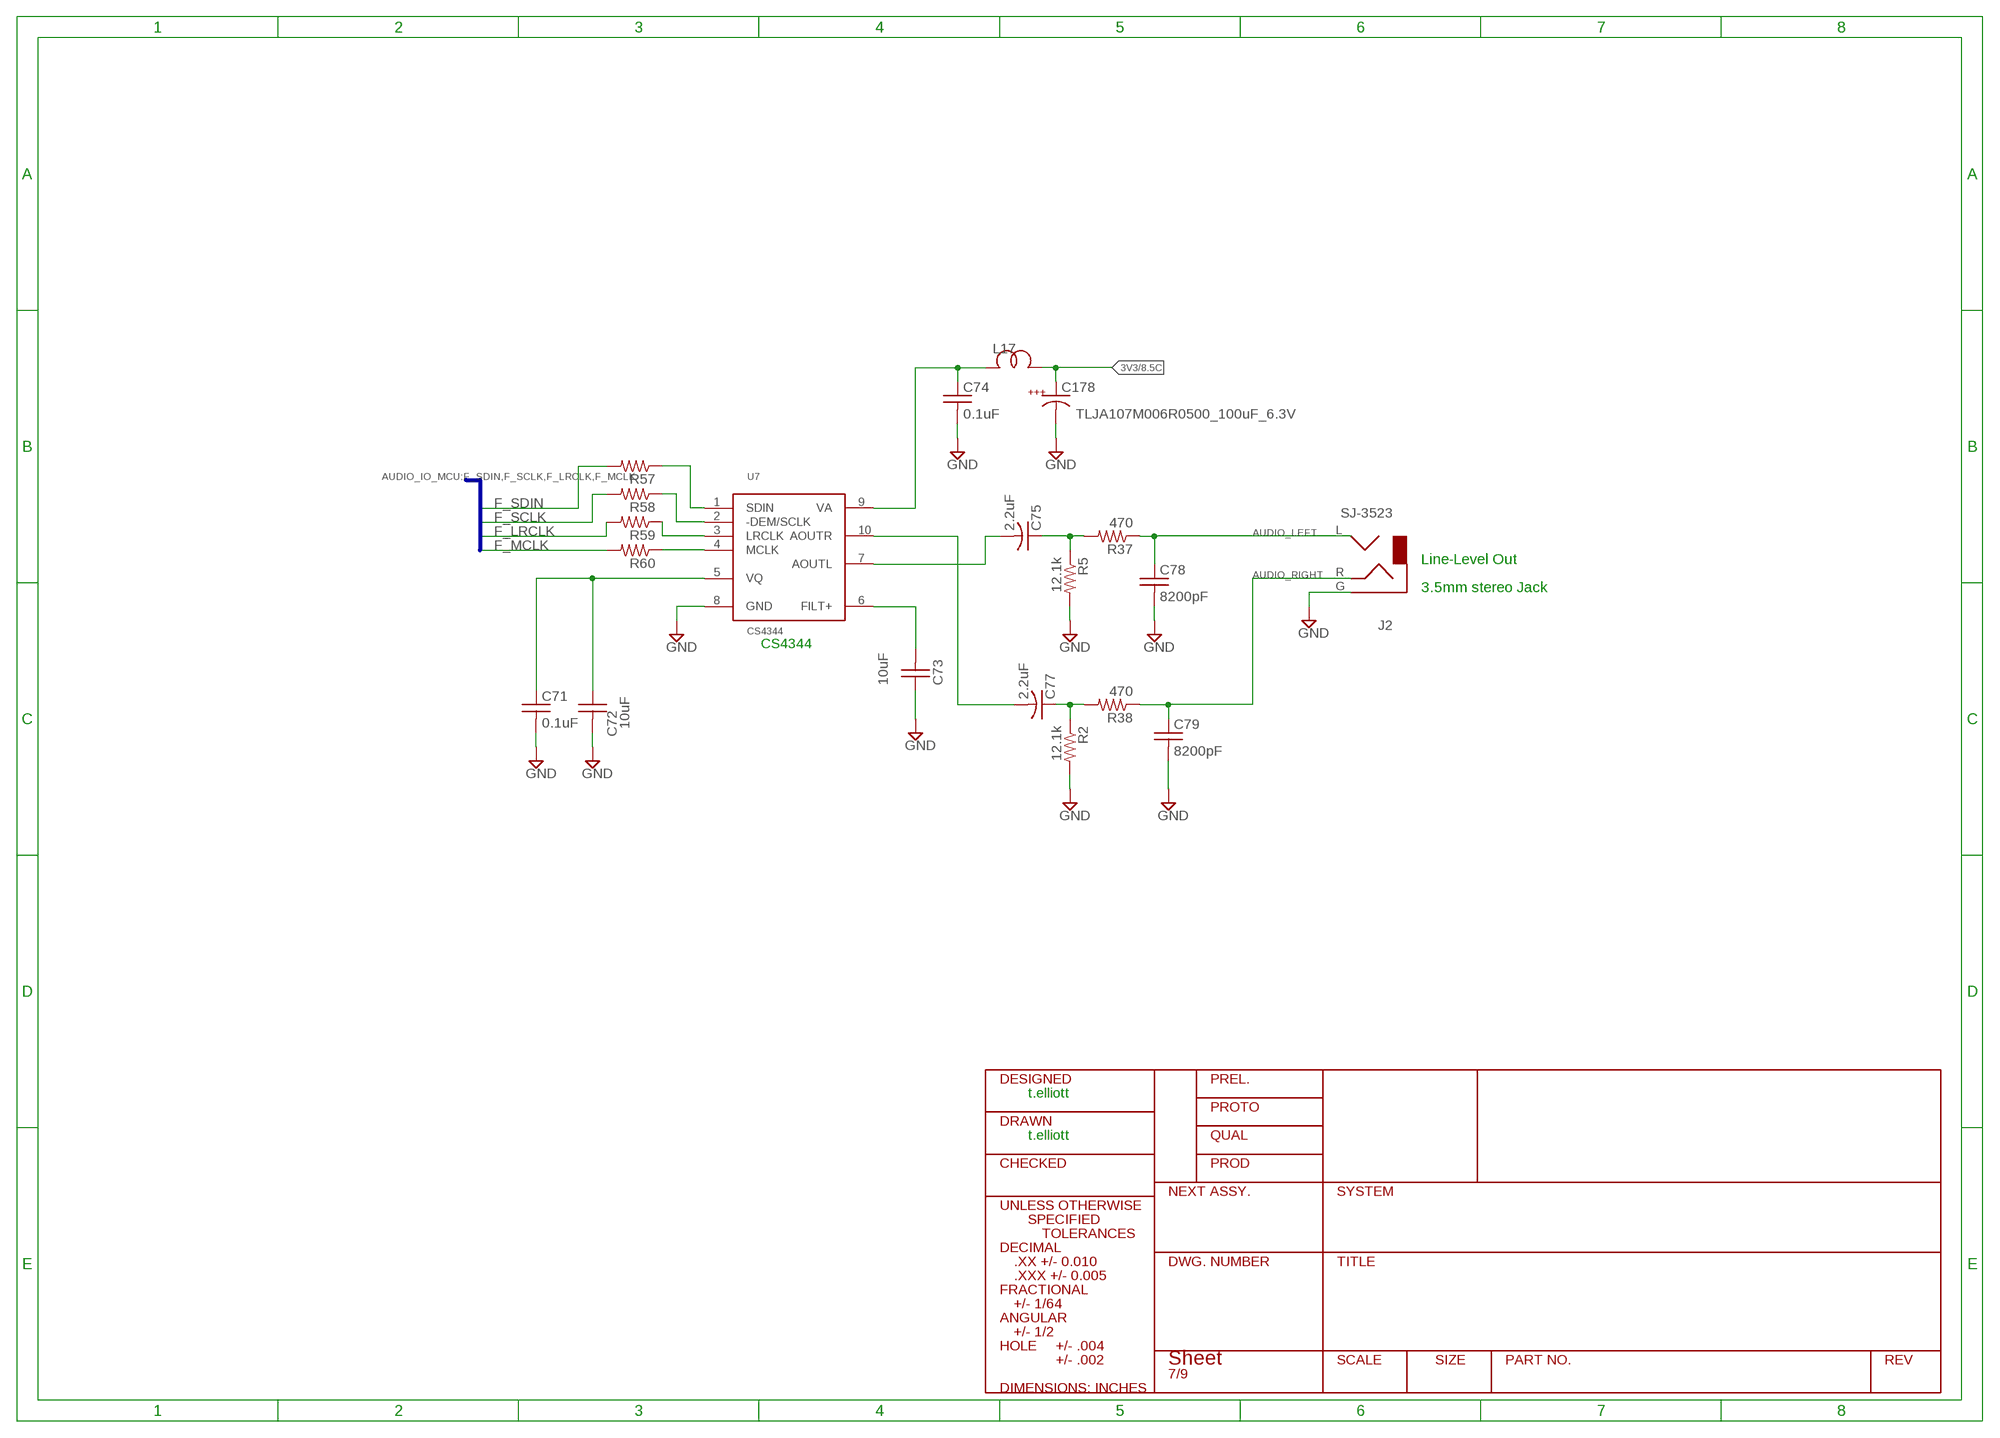
[diagram p8: schematic, sheet 7]

### Parts
C71  0.1uF  C-USC0603  [C0603]
C72  10uF  C-USC0805  [C0805]
C73  10uF  C-USC0805  [C0805]
C74  0.1uF  C-USC0603  [C0603]
C75  2.2uF  C-USC0805  [C0805]
C77  2.2uF  C-USC0805  [C0805]
C78  8200pF  C-USC0603  [C0603]
C79  8200pF  C-USC0603  [C0603]
C178  TLJA107M006R0500_100uF_6.3V  CAPACITOR1210K  [1210K]
J2  SJ-3523  CUI_SJ-3523SMT  [SJ-3523]
L17  WE-CBF_0603  [0603]
R2  12.1k  R-US_R0603  [R0603]
R5  12.1k  R-US_R0603  [R0603]
R37  470  R-US_R0402  [R0402]
R38  470  R-US_R0402  [R0402]
R57  470  R-US_R0402  [R0402]
R58  470  R-US_R0402  [R0402]
R59  470  R-US_R0402  [R0402]
R60  470  R-US_R0402  [R0402]
U7  CS4344  [MSOP10]

### Nets
3V3: C178.A L17.2 ; also sheet 3,5,8
AUDIO_LEFT: C79.1 J2.R R38.1
AUDIO_RIGHT: C78.1 J2.L R37.1
F_LRCLK: R59.2 ; also sheet 4
F_MCLK: R60.2 ; also sheet 4
F_SCLK: R58.2 ; also sheet 4
F_SDIN: R57.2 ; also sheet 4
GND: C71.2 C72.2 C73.1 C74.2 C78.2 C79.2 C178.C J2.G R2.2 R5.2 U7.8(GND) ; also sheet 1,2,3,4,5,6,8,9
N$26: C77.2 U7.10(AOUTR)
N$27: R60.1 U7.4(MCLK)
N$29: R59.1 U7.3(LRCLK)
N$34: R58.1 U7.2(-DEM/SCLK)
N$43: R57.1 U7.1(SDIN)
N$51: C73.2 U7.6(FILT+)
N$53: C71.1 C72.1 U7.5(VQ)
N$54: C75.2 U7.7(AOUTL)
N$56: C75.1 R5.1 R37.2
N$57: C77.1 R2.1 R38.2
N$66: C74.1 L17.1 U7.9(VA)

### Buses
AUDIO_IO_MCU:F_SDIN,F_SCLK,F_LRCLK,F_MCLK

### Notes on the sheet
- Line-Level Out
- 3.5mm stereo Jack
- CS4344
- t.elliott
- t.elliott

## Sheet 8 of 9
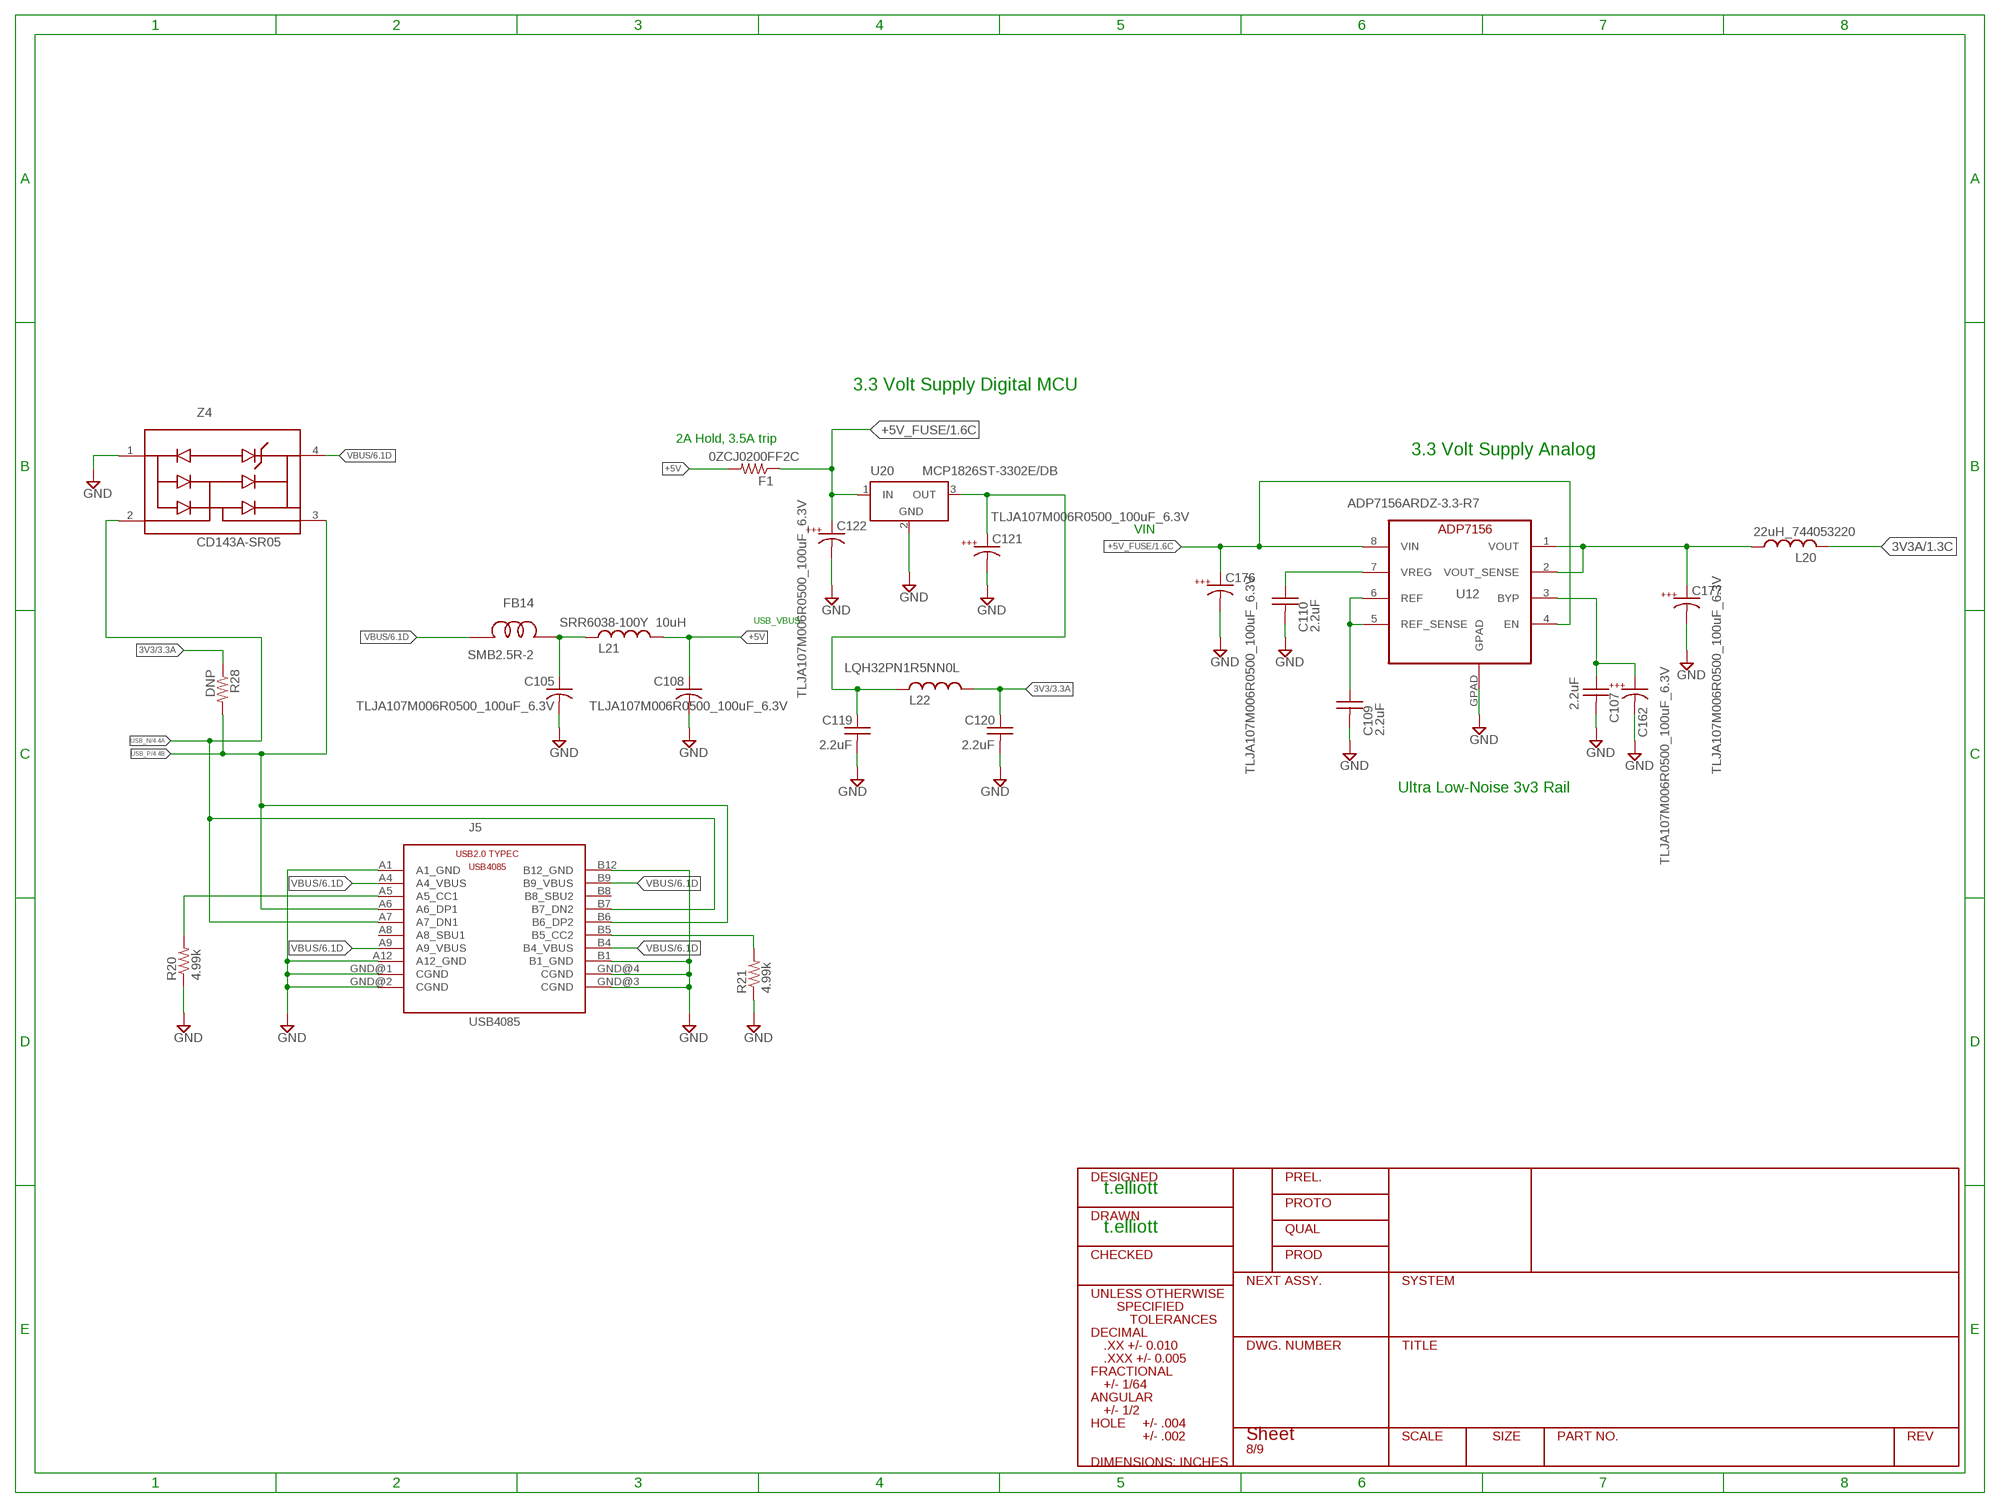
[diagram p9: schematic, sheet 8]

### Parts
C105  TLJA107M006R0500_100uF_6.3V  CAPACITOR1210K  [1210K]
C107  2.2uF  C-USC0805  [C0805]
C108  TLJA107M006R0500_100uF_6.3V  CAPACITOR1210K  [1210K]
C109  2.2uF  C-USC0805  [C0805]
C110  2.2uF  C-USC0805  [C0805]
C119  2.2uF  C-USC0603  [C0603]
C120  2.2uF  C-USC0603  [C0603]
C121  TLJA107M006R0500_100uF_6.3V  CAPACITOR1210K  [1210K]
C122  TLJA107M006R0500_100uF_6.3V  CAPACITOR1210K  [1210K]
C162  TLJA107M006R0500_100uF_6.3V  CAPACITOR1210K  [1210K]
C176  TLJA107M006R0500_100uF_6.3V  CAPACITOR1210K  [1210K]
C177  TLJA107M006R0500_100uF_6.3V  CAPACITOR1210K  [1210K]
F1  0ZCJ0200FF2C  R-US_R1206  [R1206]
FB14  SMB2.5R-2  SMB2.5  [SMB2.5-2]
J5  USB4085  [GCT_PN_USB4085]
L20  22uH_744053220  L-USWE-TPC  [POWER-CHOKE_WE-TPC]
L21  SRR6038-100Y 10uH  L-USWE-TPC  [POWER-CHOKE_WE-TPC]
L22  LQH32PN1R5NN0L  L-USL3225M  [L3225M]
R20  4.99k  R-US_R0402  [R0402]
R21  4.99k  R-US_R0402  [R0402]
R28  DNP  R-US_R0603  [R0603]
U12  ADP7156ARDZ-3.3-R7  ADP7156SO8  [SO8]
U20  MCP1826ST-3302E/DB  LT1129CST5  [SOT223]
Z4  CD143A-SR05  SR2.8_TVS  [SR2.8.TCT_1PRIMARY]

### Nets
3V3: C120.1 L22.1 R28.1 ; also sheet 3,5,7
3V3_VIN: C119.1 C121.A L22.2 U20.3(OUT)
3V3A: L20.2 ; also sheet 1,2,5
+5V: C108.A F1.2 L21.1
+5V_FUSE: C122.A C176.A F1.1 U12.4(EN) U12.8(VIN) U20.1(IN) ; also sheet 1,2
GND: C105.C C107.2 C108.C C109.2 C110.2 C119.2 C120.2 C121.C C122.C C162.C C176.C C177.C J5.A1(A1_GND) J5.A12(A12_GND) J5.B1(B1_GND) J5.B12(B12_GND) J5.GND@1(CGND) J5.GND@2(CGND) J5.GND@3(CGND) J5.GND@4(CGND) R20.1 R21.1 U12.GPAD U20.2(GND) Z4.1(GND) ; also sheet 1,2,3,4,5,6,7,9
N$20: J5.B5(B5_CC2) R21.2
N$68: C177.A L20.1 U12.1(VOUT) U12.2(VOUT_SENSE)
N$74: C109.1 U12.5(REF_SENSE) U12.6(REF)
N$76: C110.1 U12.7(VREG)
N$77: C107.1 C162.A U12.3(BYP)
N$119: C105.A FB14.P$2 L21.2
N$122: J5.A5(A5_CC1) R20.2
USB_N [differential]: J5.A7(A7_DN1) J5.B7(B7_DN2) Z4.2(I/O) ; also sheet 4
USB_P [differential]: J5.A6(A6_DP1) J5.B6(B6_DP2) R28.2 Z4.3(I/O) ; also sheet 4
VBUS: FB14.P$1 J5.A4(A4_VBUS) J5.A9(A9_VBUS) J5.B4(B4_VBUS) J5.B9(B9_VBUS) Z4.4(REF) ; also sheet 6
Unconnected: J5.A8(A8_SBU1) J5.B8(B8_SBU2)

### Notes on the sheet
- 3.3 Volt Supply Digital MCU
- 2A Hold, 3.5A trip
- 3.3 Volt Supply Analog
- VIN
- USB_VBUS
- Ultra Low-Noise 3v3 Rail
- t.elliott
- t.elliott

## Sheet 9 of 9
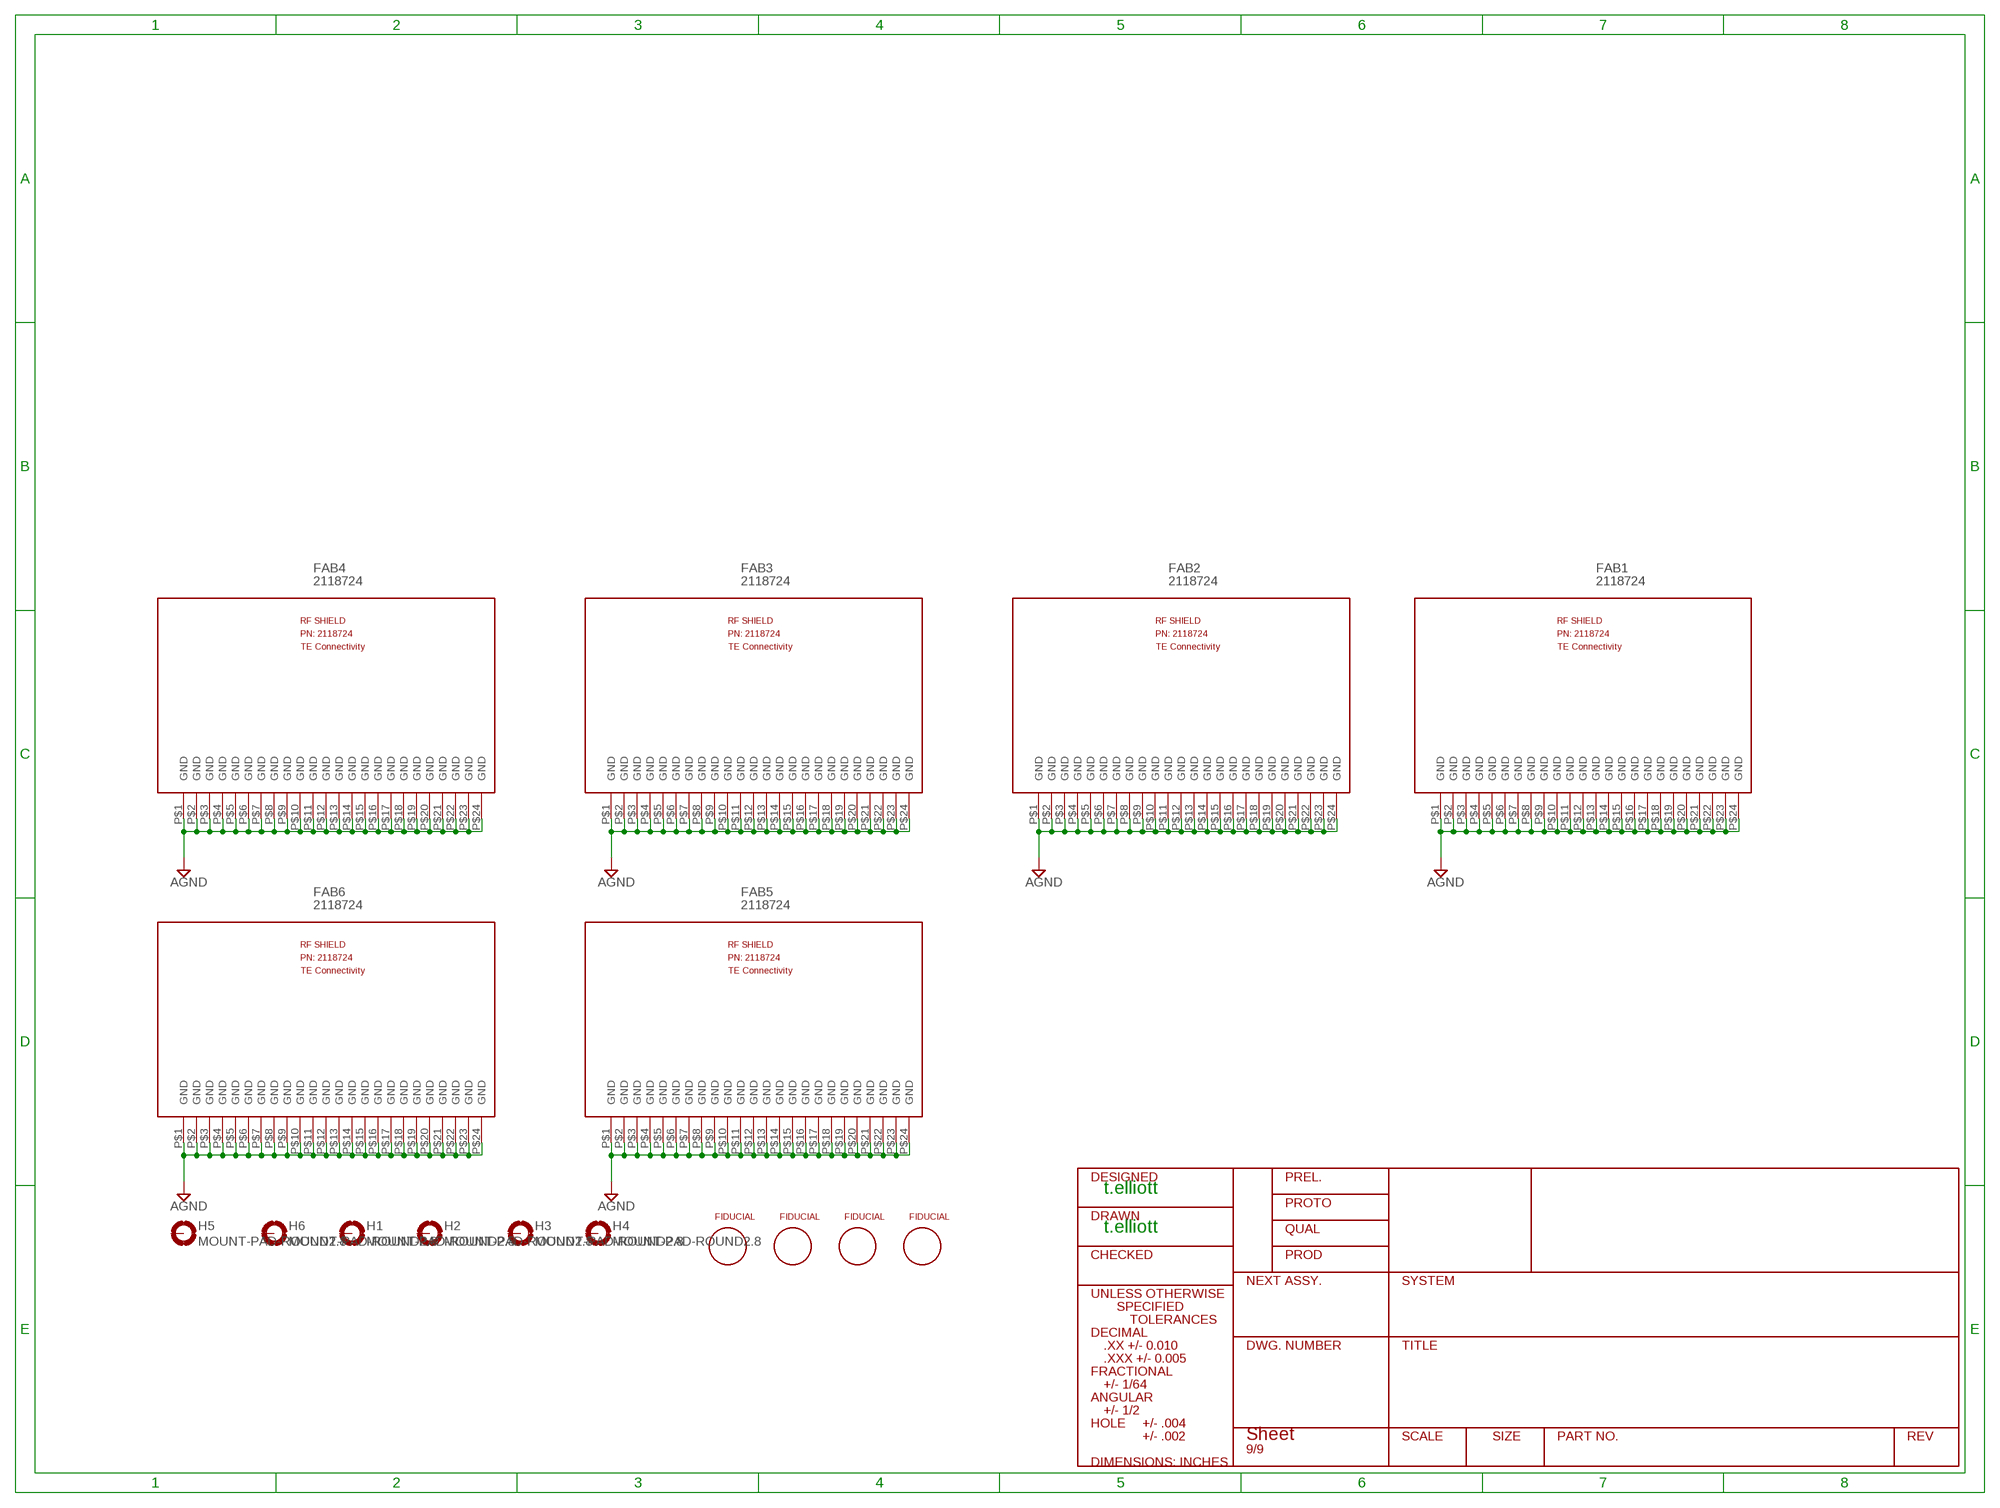
[diagram p10: schematic, sheet 9]

### Parts
FAB1  2118724  RF_SHIELD_PN_2118724  [RF_SHIELD]
FAB2  2118724  RF_SHIELD_PN_2118724  [RF_SHIELD]
FAB3  2118724  RF_SHIELD_PN_2118724  [RF_SHIELD]
FAB4  2118724  RF_SHIELD_PN_2118724  [RF_SHIELD]
FAB5  2118724  RF_SHIELD_PN_2118724  [RF_SHIELD]
FAB6  2118724  RF_SHIELD_PN_2118724  [RF_SHIELD]
FID1  FIDUCIALSMD  [FIDUCIAL]
FID2  FIDUCIALSMD  [FIDUCIAL]
FID3  FIDUCIALSMD  [FIDUCIAL]
FID4  FIDUCIALSMD  [FIDUCIAL]
H1  MOUNT-PAD-ROUND2.8  [2,8-PAD]
H2  MOUNT-PAD-ROUND2.8  [2,8-PAD]
H3  MOUNT-PAD-ROUND2.8  [2,8-PAD]
H4  MOUNT-PAD-ROUND2.8  [2,8-PAD]
H5  MOUNT-PAD-ROUND2.8  [2,8-PAD]
H6  MOUNT-PAD-ROUND2.8  [2,8-PAD]

### Nets
GND: FAB1.P$1(GND) FAB1.P$2(GND) FAB1.P$3(GND) FAB1.P$4(GND) FAB1.P$5(GND) FAB1.P$6(GND) FAB1.P$7(GND) FAB1.P$8(GND) FAB1.P$9(GND) FAB1.P$10(GND) FAB1.P$11(GND) FAB1.P$12(GND) FAB1.P$13(GND) FAB1.P$14(GND) FAB1.P$15(GND) FAB1.P$16(GND) FAB1.P$17(GND) FAB1.P$18(GND) FAB1.P$19(GND) FAB1.P$20(GND) FAB1.P$21(GND) FAB1.P$22(GND) FAB1.P$23(GND) FAB1.P$24(GND) FAB2.P$1(GND) FAB2.P$2(GND) FAB2.P$3(GND) FAB2.P$4(GND) FAB2.P$5(GND) FAB2.P$6(GND) FAB2.P$7(GND) FAB2.P$8(GND) FAB2.P$9(GND) FAB2.P$10(GND) FAB2.P$11(GND) FAB2.P$12(GND) FAB2.P$13(GND) FAB2.P$14(GND) FAB2.P$15(GND) FAB2.P$16(GND) FAB2.P$17(GND) FAB2.P$18(GND) FAB2.P$19(GND) FAB2.P$20(GND) FAB2.P$21(GND) FAB2.P$22(GND) FAB2.P$23(GND) FAB2.P$24(GND) FAB3.P$1(GND) FAB3.P$2(GND) FAB3.P$3(GND) FAB3.P$4(GND) FAB3.P$5(GND) FAB3.P$6(GND) FAB3.P$7(GND) FAB3.P$8(GND) FAB3.P$9(GND) FAB3.P$10(GND) FAB3.P$11(GND) FAB3.P$12(GND) FAB3.P$13(GND) FAB3.P$14(GND) FAB3.P$15(GND) FAB3.P$16(GND) FAB3.P$17(GND) FAB3.P$18(GND) FAB3.P$19(GND) FAB3.P$20(GND) FAB3.P$21(GND) FAB3.P$22(GND) FAB3.P$23(GND) FAB3.P$24(GND) FAB4.P$1(GND) FAB4.P$2(GND) FAB4.P$3(GND) FAB4.P$4(GND) FAB4.P$5(GND) FAB4.P$6(GND) FAB4.P$7(GND) FAB4.P$8(GND) FAB4.P$9(GND) FAB4.P$10(GND) FAB4.P$11(GND) FAB4.P$12(GND) FAB4.P$13(GND) FAB4.P$14(GND) FAB4.P$15(GND) FAB4.P$16(GND) FAB4.P$17(GND) FAB4.P$18(GND) FAB4.P$19(GND) FAB4.P$20(GND) FAB4.P$21(GND) FAB4.P$22(GND) FAB4.P$23(GND) FAB4.P$24(GND) FAB5.P$1(GND) FAB5.P$2(GND) FAB5.P$3(GND) FAB5.P$4(GND) FAB5.P$5(GND) FAB5.P$6(GND) FAB5.P$7(GND) FAB5.P$8(GND) FAB5.P$9(GND) FAB5.P$10(GND) FAB5.P$11(GND) FAB5.P$12(GND) FAB5.P$13(GND) FAB5.P$14(GND) FAB5.P$15(GND) FAB5.P$16(GND) FAB5.P$17(GND) FAB5.P$18(GND) FAB5.P$19(GND) FAB5.P$20(GND) FAB5.P$21(GND) FAB5.P$22(GND) FAB5.P$23(GND) FAB5.P$24(GND) FAB6.P$1(GND) FAB6.P$2(GND) FAB6.P$3(GND) FAB6.P$4(GND) FAB6.P$5(GND) FAB6.P$6(GND) FAB6.P$7(GND) FAB6.P$8(GND) FAB6.P$9(GND) FAB6.P$10(GND) FAB6.P$11(GND) FAB6.P$12(GND) FAB6.P$13(GND) FAB6.P$14(GND) FAB6.P$15(GND) FAB6.P$16(GND) FAB6.P$17(GND) FAB6.P$18(GND) FAB6.P$19(GND) FAB6.P$20(GND) FAB6.P$21(GND) FAB6.P$22(GND) FAB6.P$23(GND) FAB6.P$24(GND) ; supply symbol labelled AGND ; also sheet 1,2,3,4,5,6,7,8
Unconnected: H1.B2,8(MOUNT) H2.B2,8(MOUNT) H3.B2,8(MOUNT) H4.B2,8(MOUNT) H5.B2,8(MOUNT) H6.B2,8(MOUNT)

### Notes on the sheet
- t.elliott
- t.elliott

## Power pins joined to a net without a drawn wire
GND: U20.4(GND) U23.4(GND) U24.4(GND)

## Library data of the parts
BAL1 = tdk:BALUN_TDK_HHM1522B1
C1-C4 C6-C20 C22-C32 C34 C36-C46 C48-C52 C57 C60-C62 C68-C70 C81-C84 C93 C95 C97 C103 C104 C112-C114 C117-C120 C123 C124 C127 C130-C142 C144-C152 C156-C158 C163 C164 C167-C171 C179 C180 C184 C185 = misc6:C-US: CAPACITOR, American symbol
C5 C21 C63-C67 C128 C129 C166 = misc9:C-US: CAPACITOR, American symbol
C33 C35 C53-C56 C58 C59 C76 C80 C99 C100 C102 C106 C111 C115 C116 C121 C122 C125 C126 C143 C153-C155 C159-C162 C165 C172-C178 C181 = misc5:CAPACITOR
C47 C85-C92 C94 C96 C98 C101 C105 C108 = misclib4:CAPACITOR
C71-C74 C78 C79 C107 C109 C110 = misclib3:C-US: CAPACITOR, American symbol
C75 C77 C182 C183 = resistor:C-US: CAPACITOR, American symbol
D1-D6 = misc1:SMP1321-079LF
D8 = pinhead:PINHD-1X3: PIN HEADER
D20 = misc1:LED-APA3010_1PRIMARY
F1 F2 R63 R67 = resistor:R-US_: RESISTOR, American symbol
FAB1-FAB6 = rf_shield_pn_2118724:RF_SHIELD_PN_2118724
FB14 = api_delevan_ferrite:SMB2.5
FID1-FID4 = misclib2:FIDUCIAL
FLT1 FLT3 FLT5 = 0868lp15a020:0868LP15A020E
FLT2 FLT4 = murata_saw:SF2049E
H1-H6 = holes:MOUNT-PAD-ROUND: MOUNTING PAD, round
J1 = con-stewart:SI-50170: Ethernet Connector MagJack (R) Source: www.stewartconnector.com .. si-50170.pdf; OC_FARNELL: unknown; OC_NEWARK: unknown
J2 = misclib3:CUI_SJ-3523
J3 = misc6:SMA
J4 J10 J11 = amp_ufl:AMPHENOL_A-1JB
J5 = GCT_usb4085:USB4085
J8 = connector:TC2030-CTX: Tag Connect footprint for ARM JTAG. 10 pin ARM Cortex Debug Connector.
JP1 = pinhead:PINHD-1X6: PIN HEADER
JP2 = pinhead:PINHD-1X2: PIN HEADER
L1-L3 L5 L10 L18 L26 L28 L30-L33 = rcl:COILCRAFT_0806SQ-16N
L4 L13 L17 L19 L27 L34-L37 = wuerth-elektronik:WE-CBF: SMD EMI Suppression Ferrite Beads - excellent anti-EMI properties - low DCR - impedances till 3000 ohms - rated current up to 6 A
L6 L7 L14 L15 = tcch-80+:TCCH-80+
L8 L9 L11 L12 L16 L22-L25 L29 = rcl:L-US: INDUCTOR, American symbol; PARTNUMBER: ELJ-PA331KF
L20 L21 = rcl:L-US: INDUCTOR, American symbol
R1-R6 R9-R11 R14-R18 R20 R21 R23-R26 R28 R30-R33 R42 R44-R48 R50-R56 R62 R75-R77 R79 R80 R102-R105 = misc9:R-US_: RESISTOR, American symbol
R7 R8 R12 R13 R35 R36 R39 R40 = misc6:R-US_: RESISTOR, American symbol
R19 R22 R27 R29 R34 R37 R38 R41 R43 R49 R57-R61 R64-R66 R68-R74 R78 = misclib3:R-US_: RESISTOR, American symbol
SW7 = e-switch_tactile:45X45MM_TL3315: E-Switch, TL3315, Tactile 4.5 x 4.5mm
TP1 = testpad:PTR1: TEST PIN
U1 U15 U16 = linear:*1458: OP AMP
U2 U6 = ltc6948_synth:LTC6948
U3 U4 U10 U21 = rfmd_sot89:PGA-103+
U7 = cirrus-3:CS4344
U8 = minicircuits:SYM-18H
U9 = misclib2:STM32F407_144_MG: stm32f407_144 edit this description Auto generated by make-symbol-device-package-bsdl.ulp Rev. 43 Source: stm32f407_144.txt Connect-List generated from STM32F407_144.DEV Variant 144 with split-device-symbol.ulp
U11 = ltc5586:LTC5586
U12 = analog_devices:ADP7156
U13 U14 = ltc1564:LTC1564
U17 U19 = ltc6910:LTC6910
U18 = lan8742:LAN8742
U20 U23 U24 = linear-technology:LT1129CST5: VOLTAGE REGULATOR with shutdown; MPN: LT1129CST-5#PBF; OC_FARNELL: 1663375; OC_NEWARK: 57M2069
U25 = peregrine:PE43712
X1 X2 = ecs_crystal:ECS-250-20-30B-DU
X3 = connor_winfield:CWX813-020.0M
Z1 Z2 Z4 = misc8:SR2.8_TVS

## Net classes
1 differential: width 0.127 mm, clearance 0.127 mm